# Altium schematic sheet Ctrl_Board.SchDoc
size 1016 x 673 mm
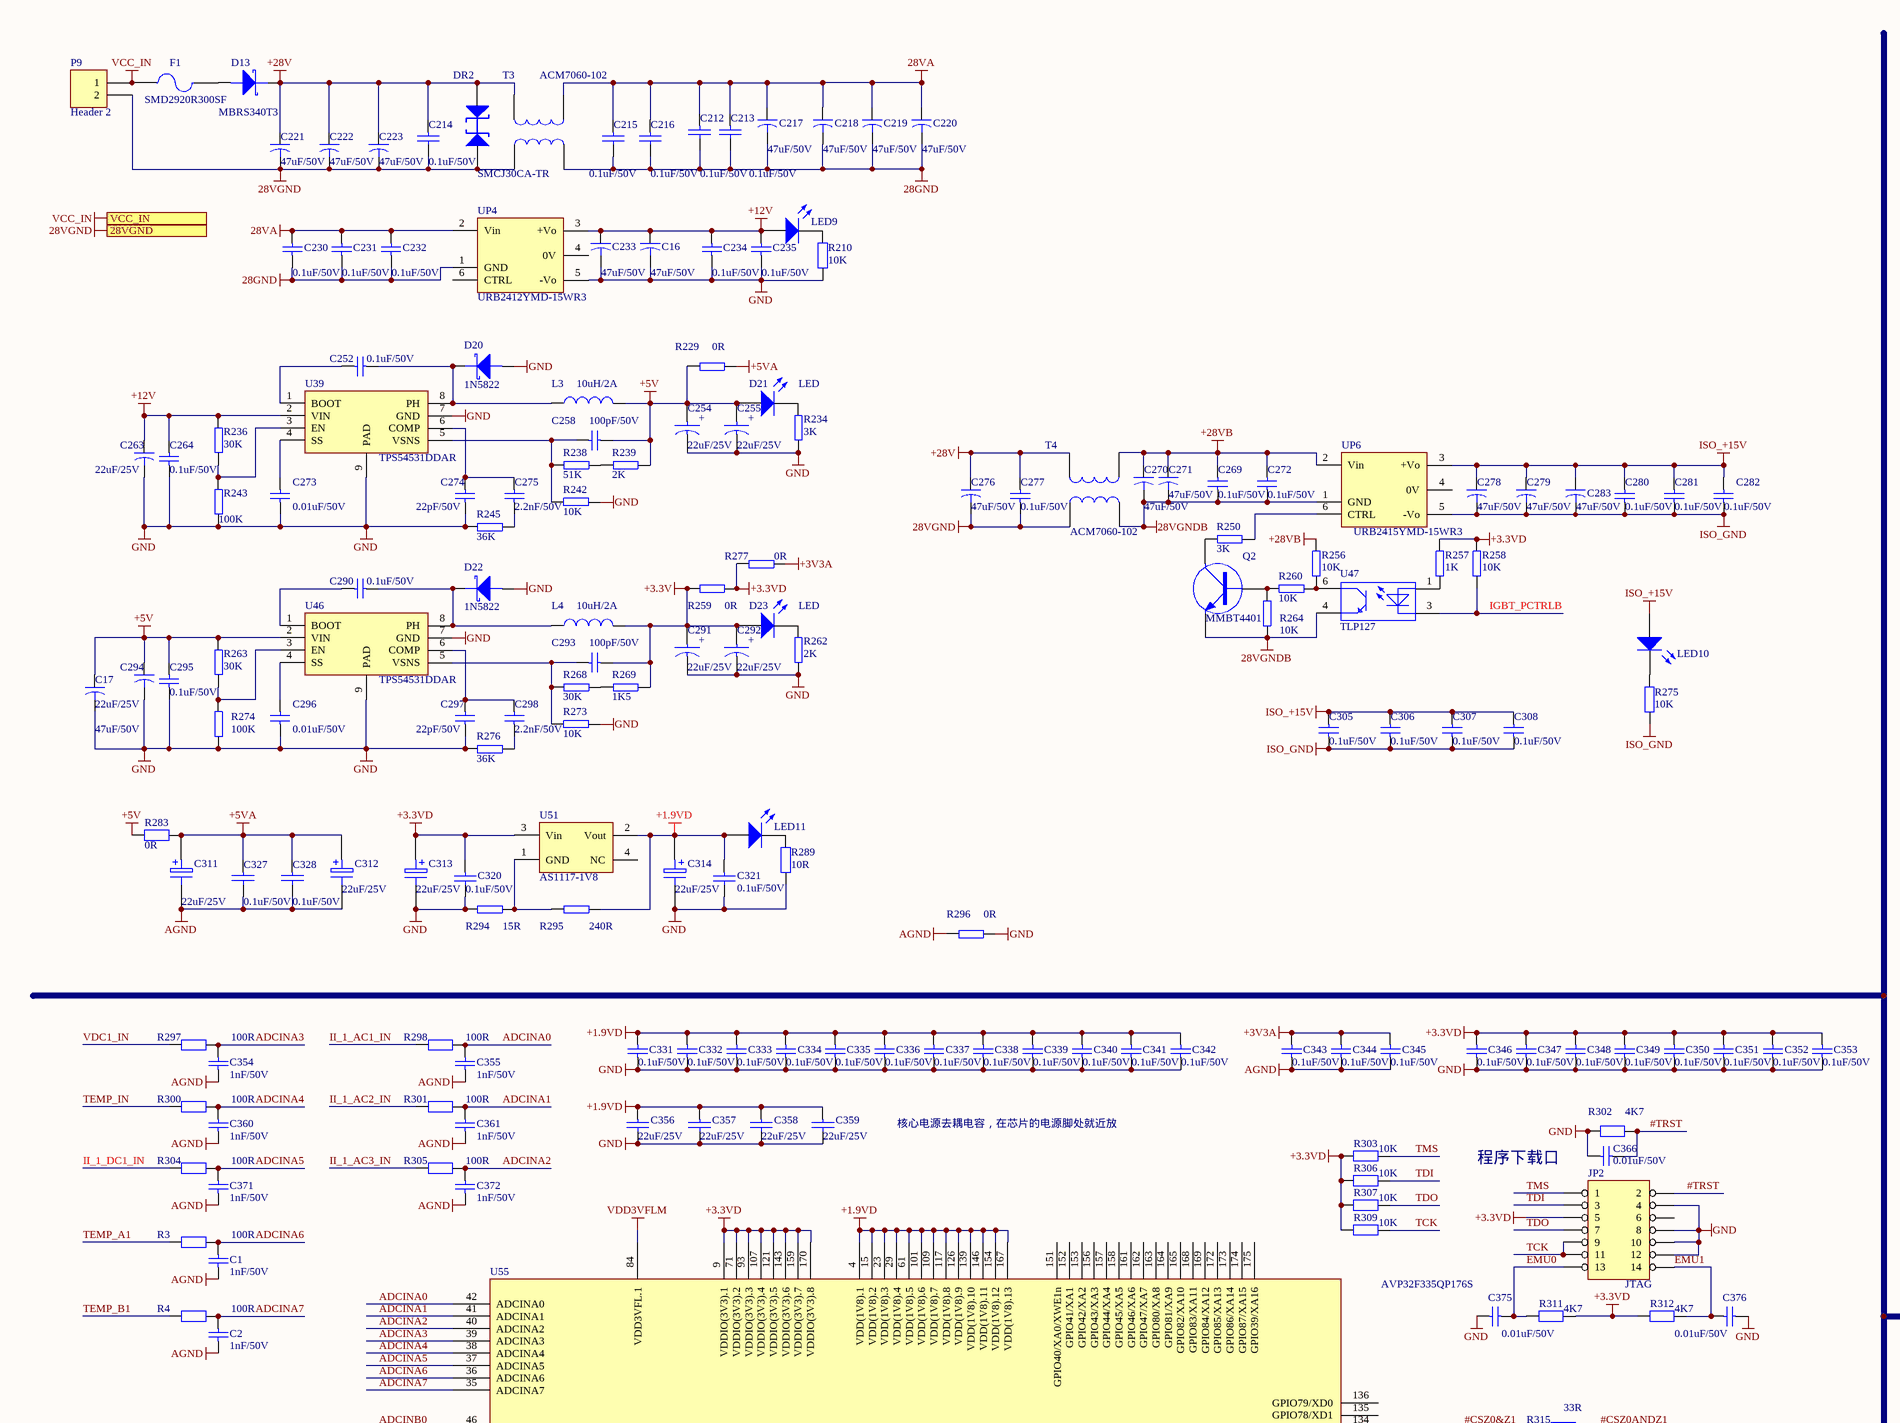
[diagram p0: Ctrl_Board.SchDoc, top left]
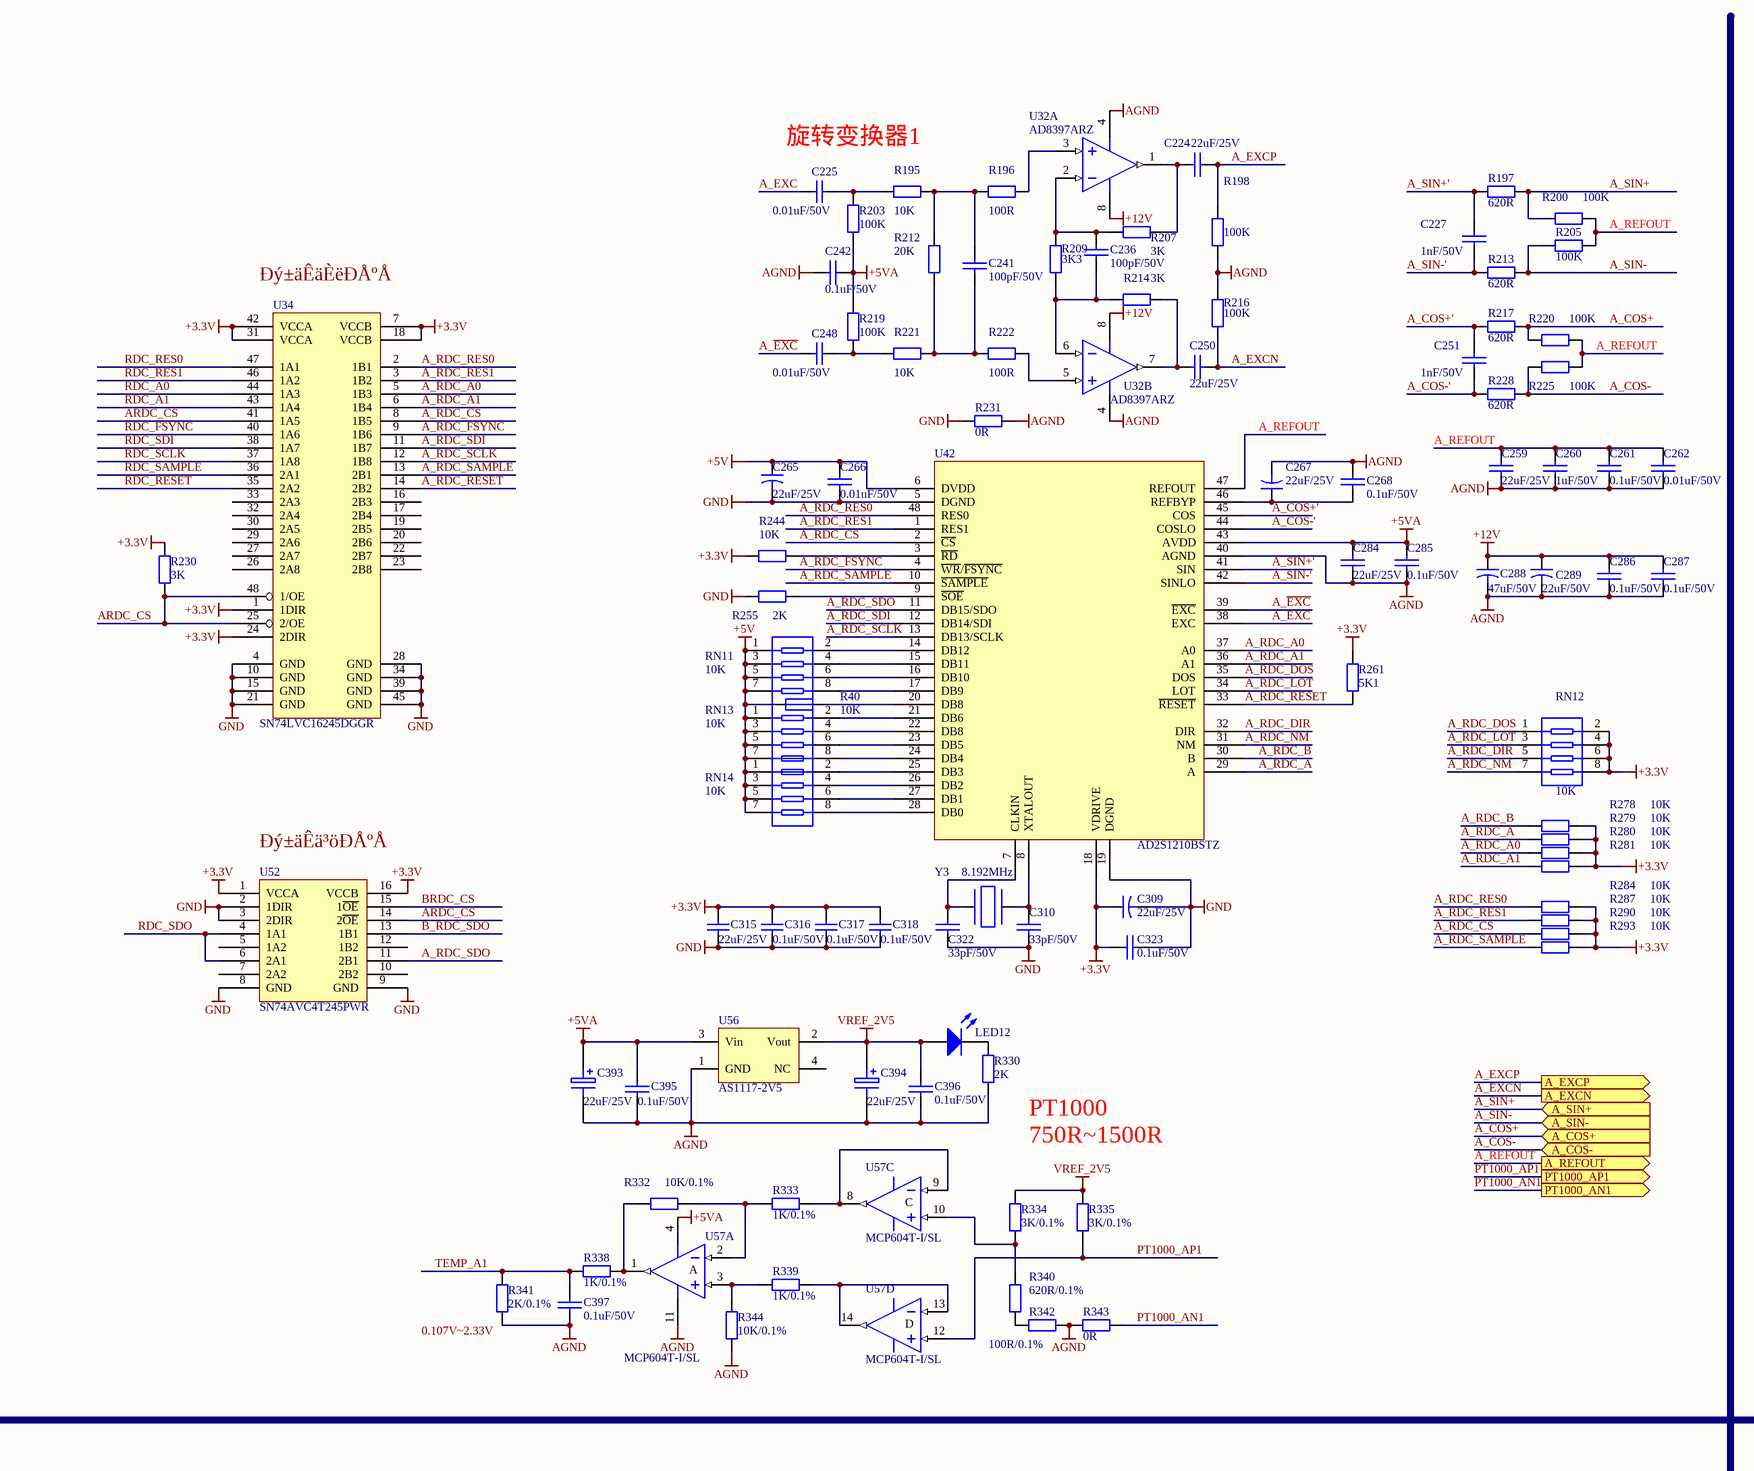
[diagram p1: Ctrl_Board.SchDoc, top middle]
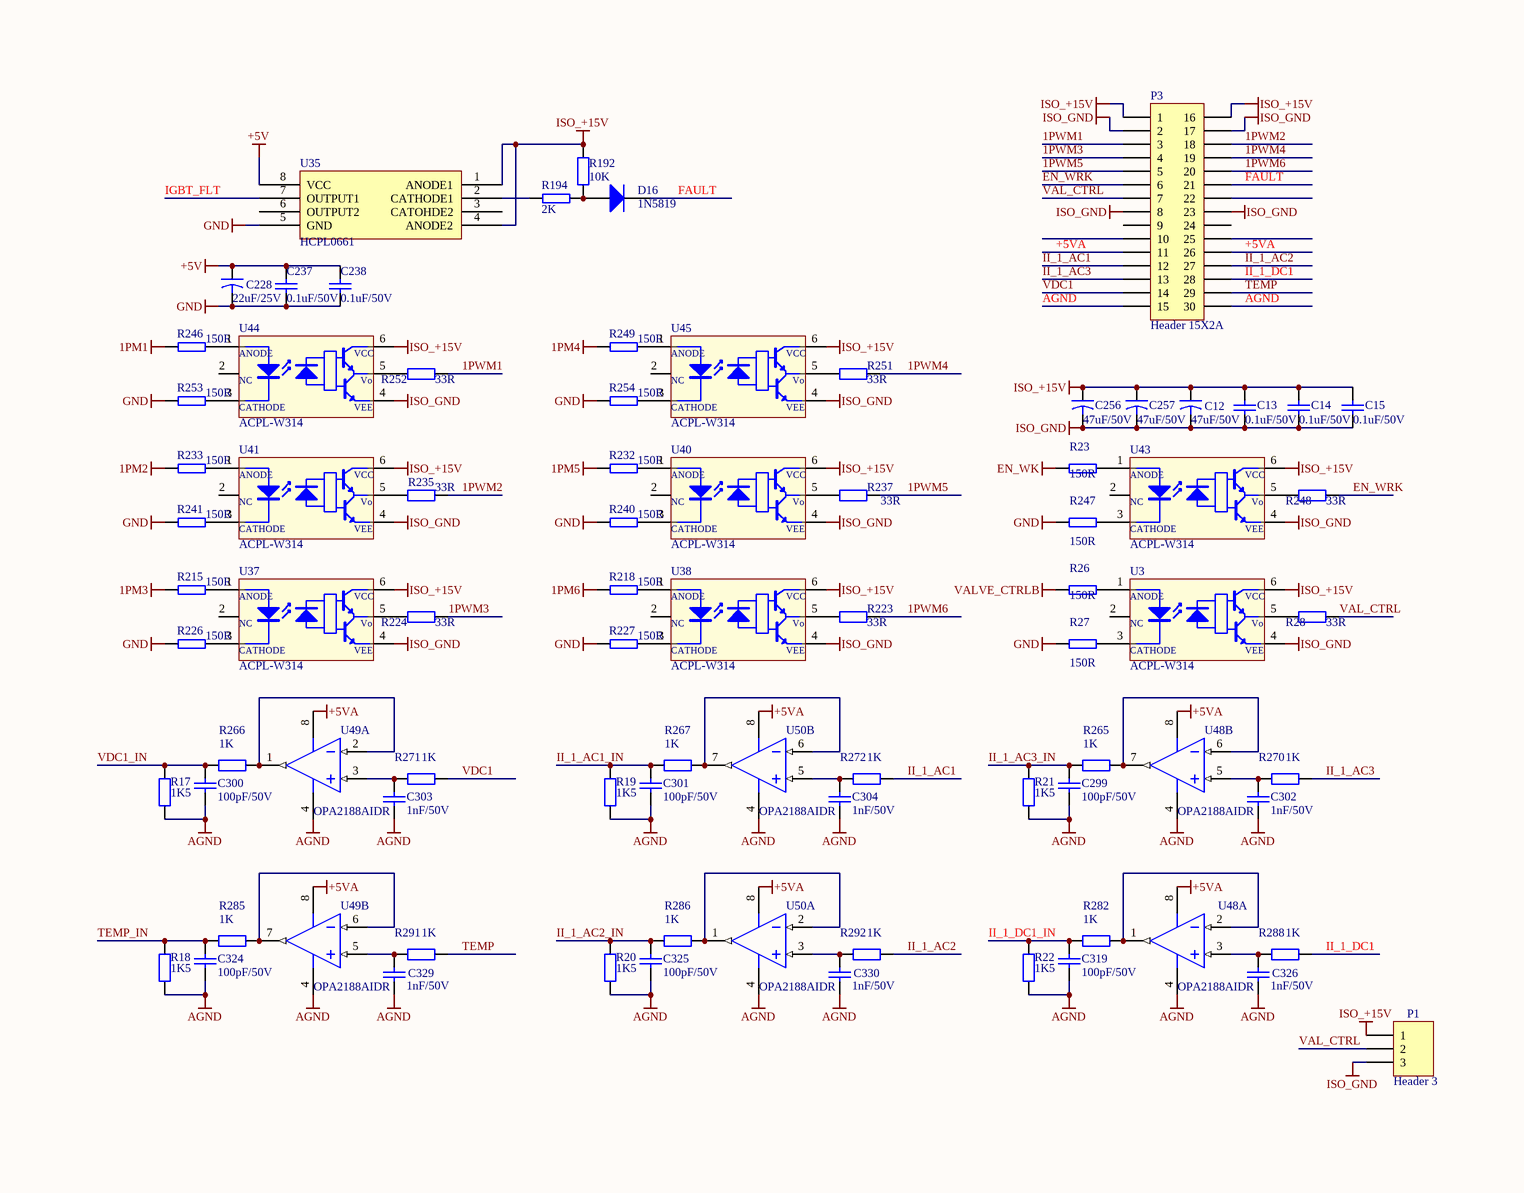
[diagram p2: Ctrl_Board.SchDoc, top right]
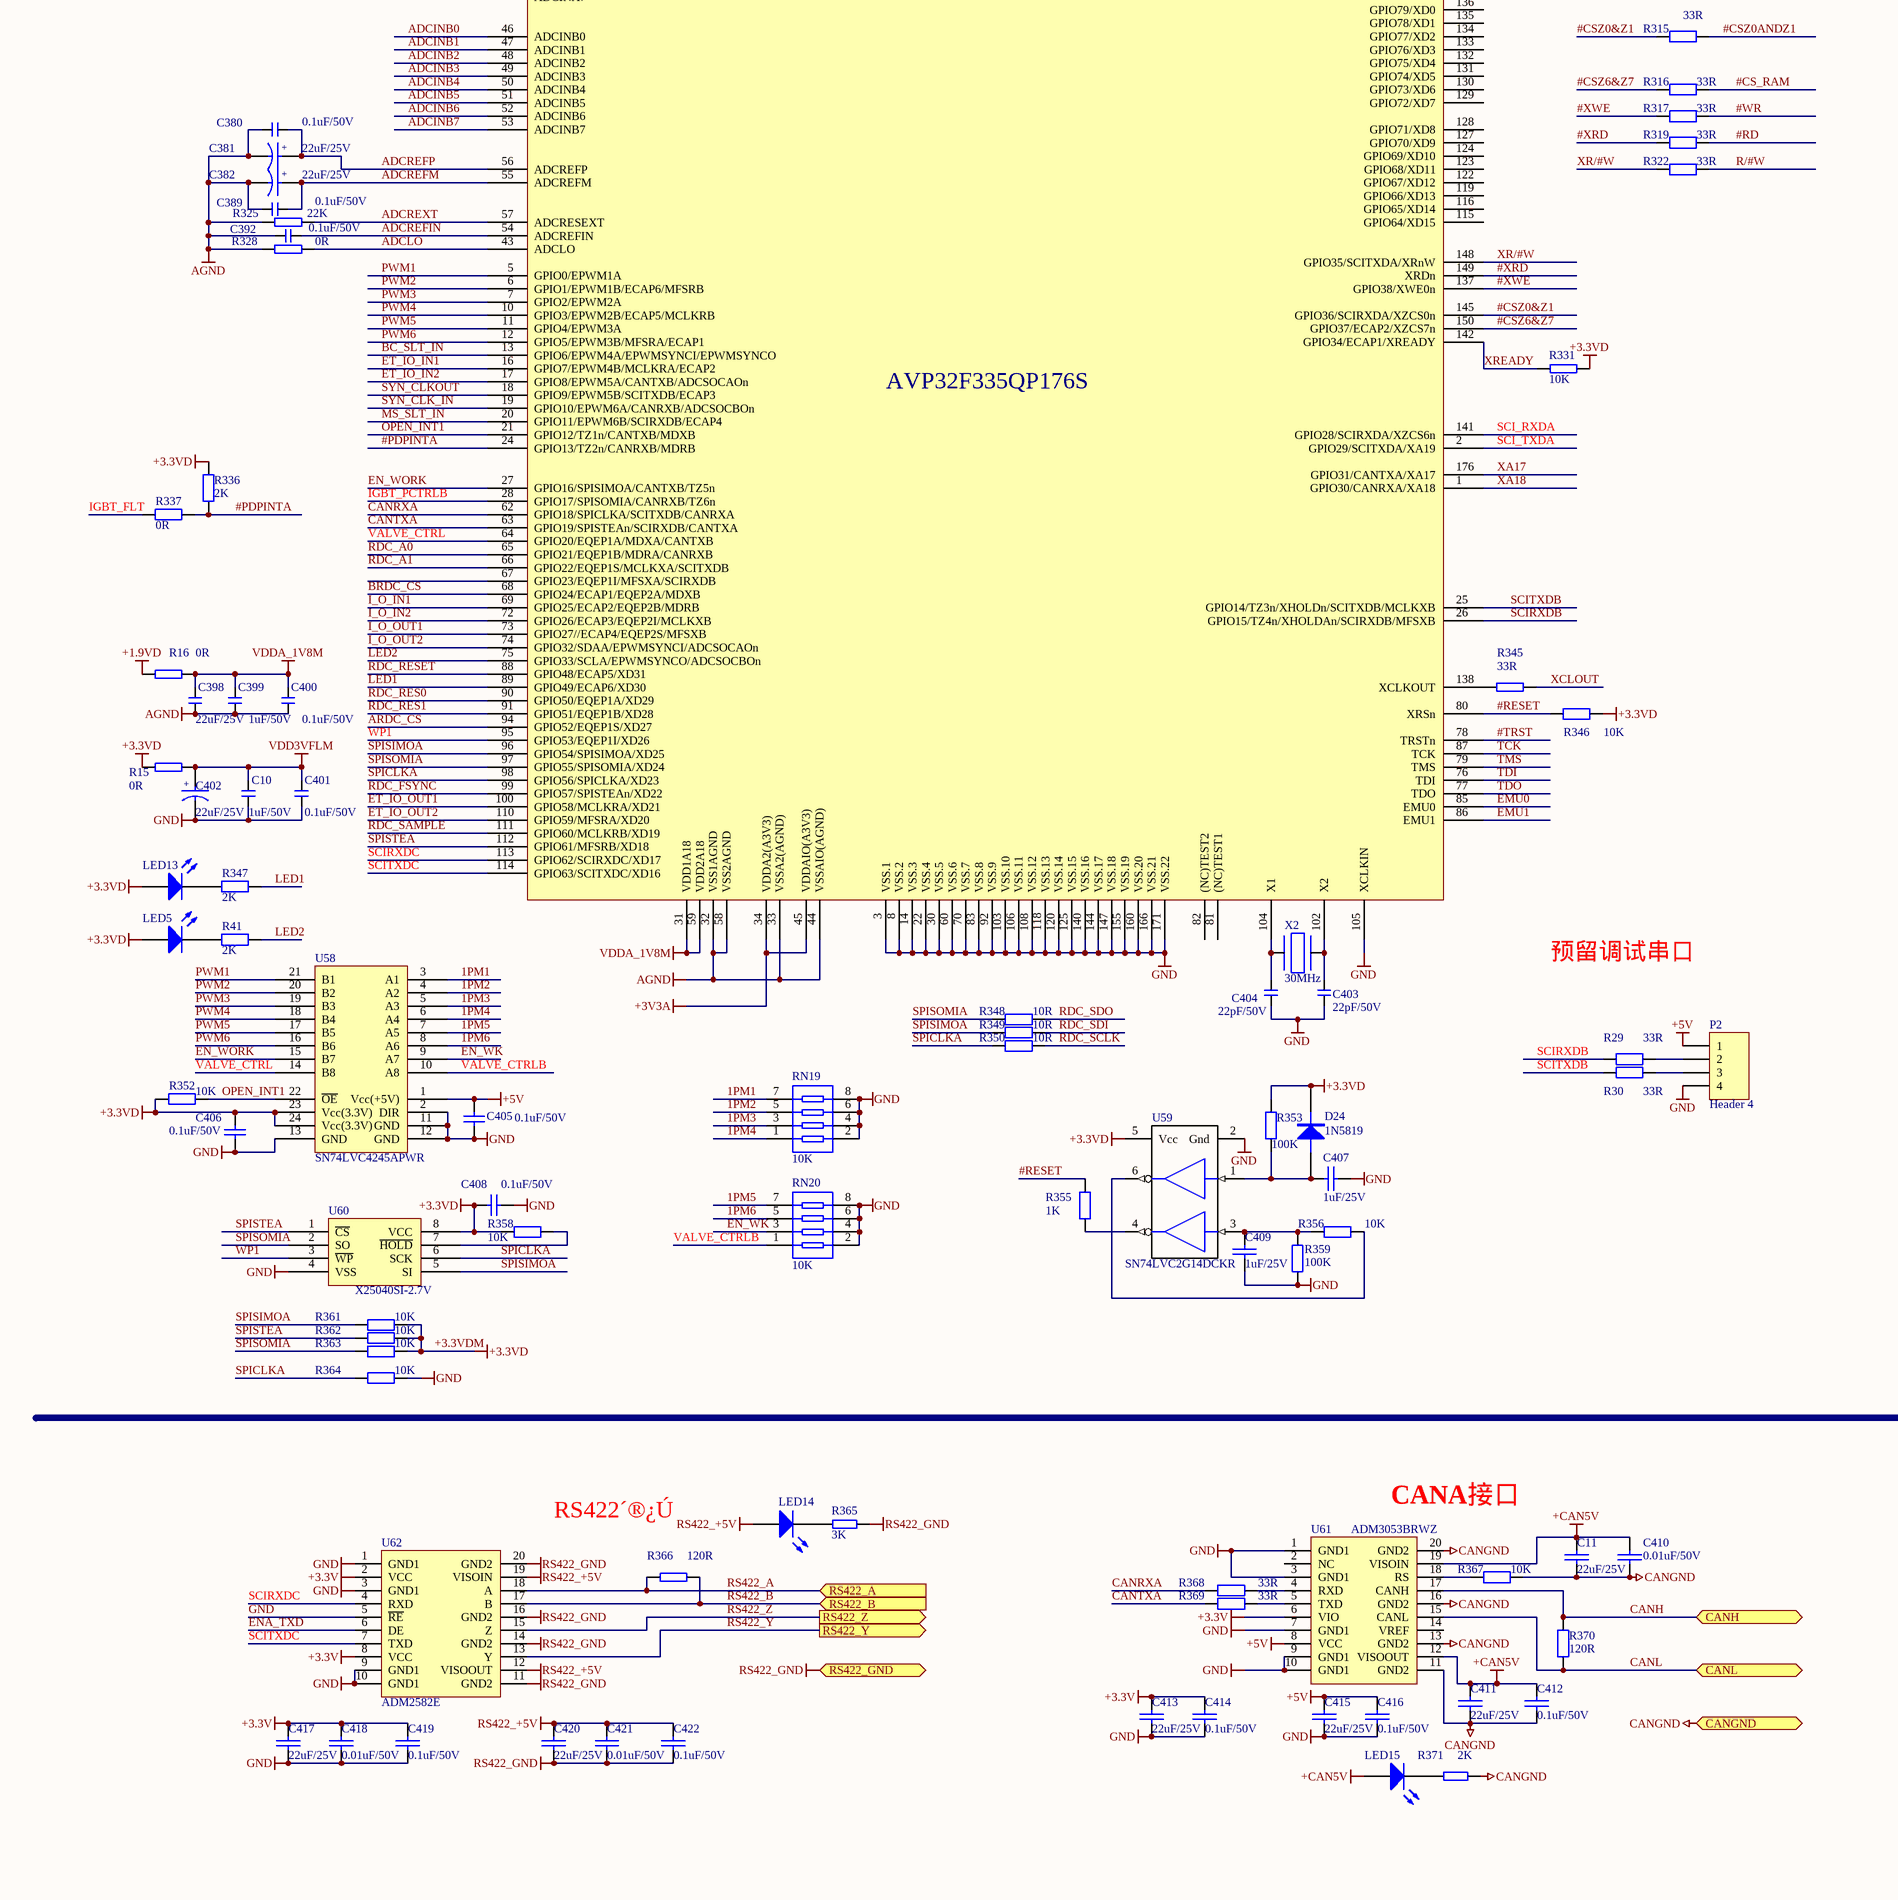
[diagram p3: Ctrl_Board.SchDoc, bottom left]
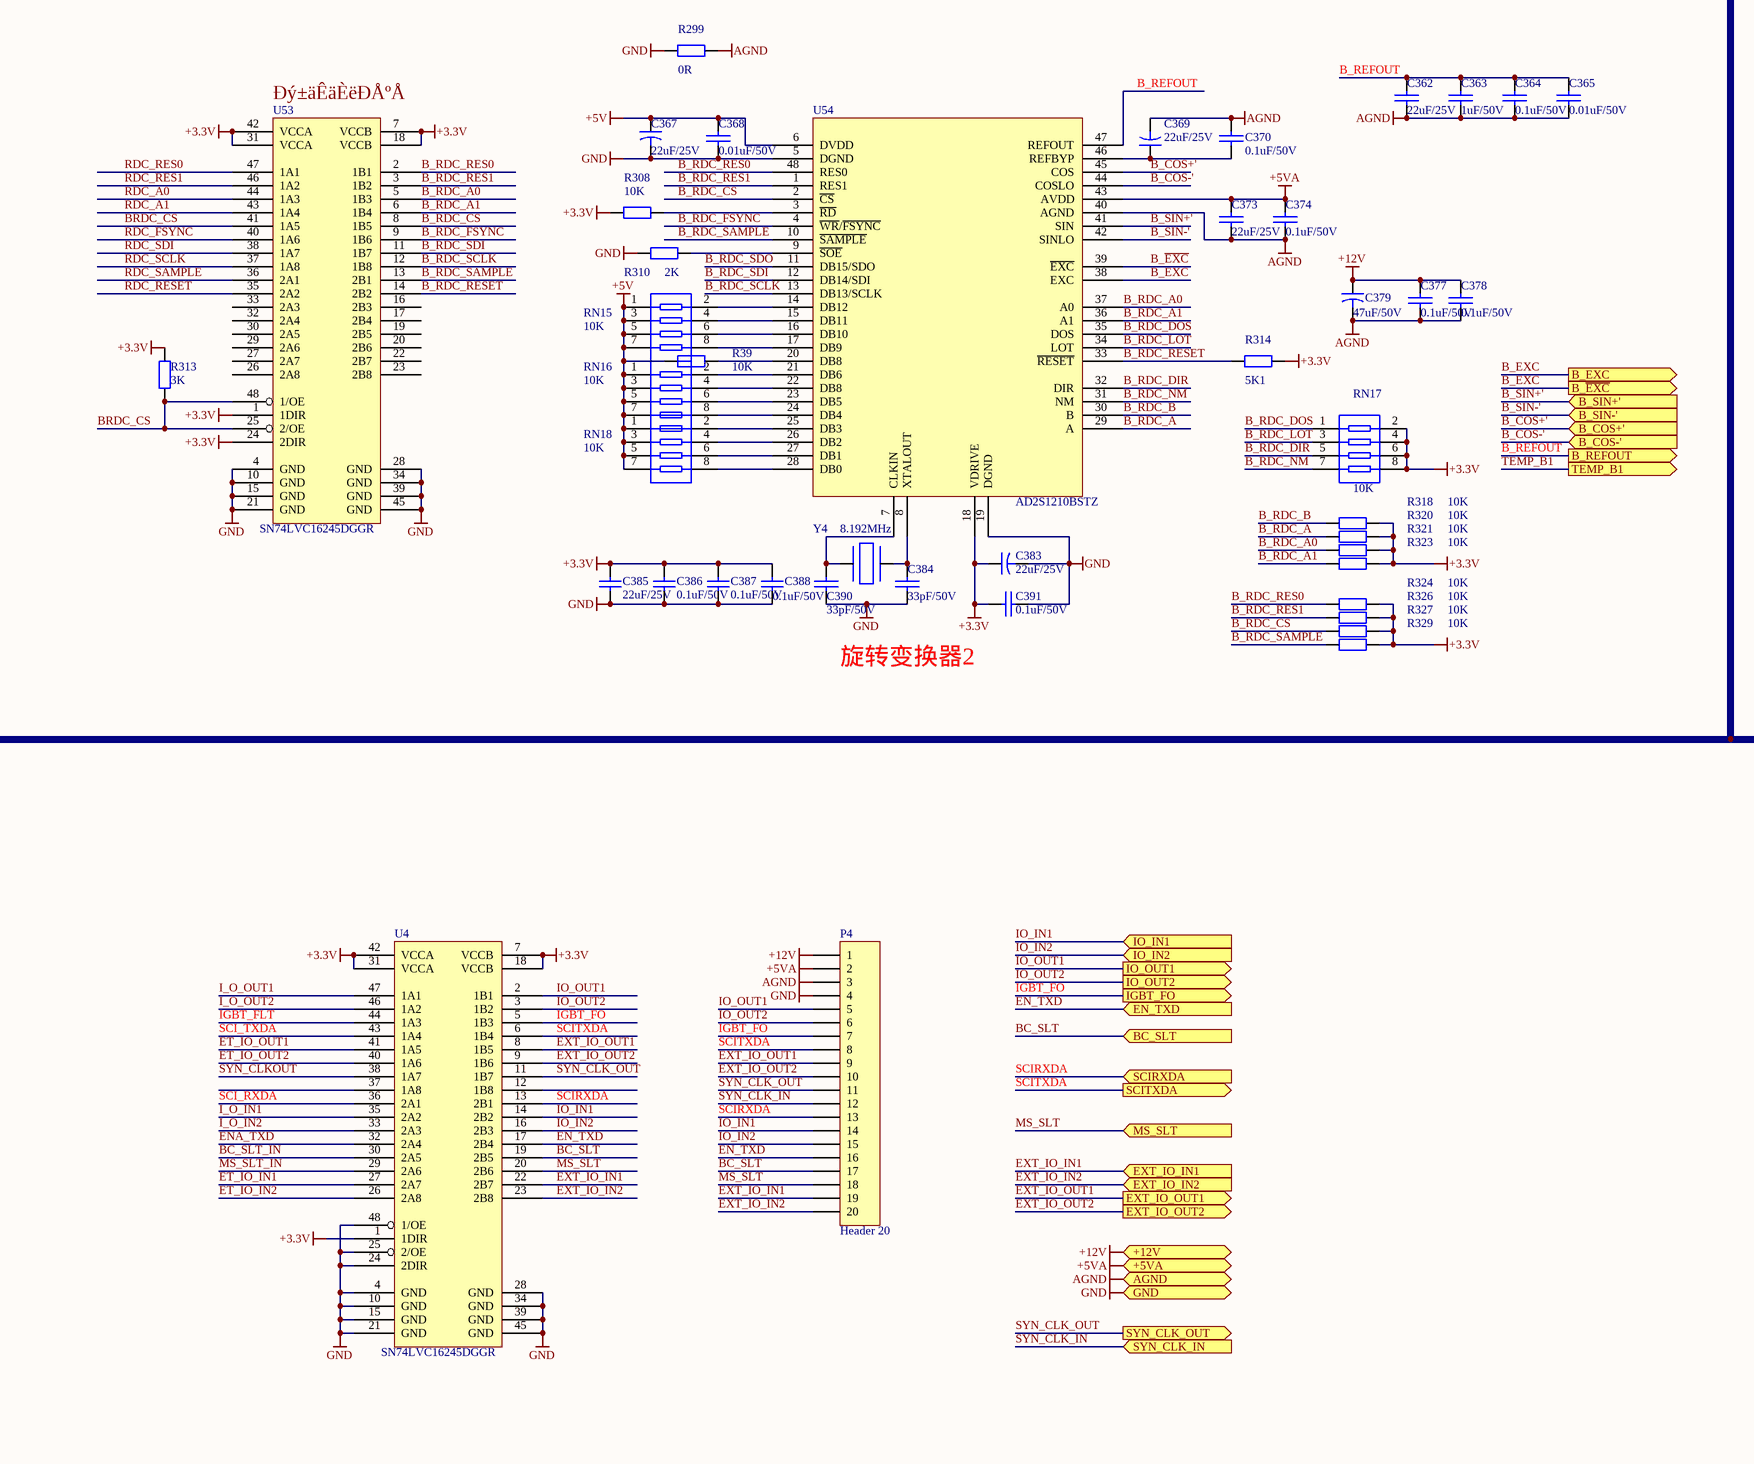
[diagram p4: Ctrl_Board.SchDoc, bottom middle]

## Parts
C1  1nF/50V  [WP_0603C]
C2  1nF/50V  [WP_0603C]
C10  1uF/50V  [WP_0603C]
C11  22uF/25V  [WP_1206CC]
C12  47uF/50V  [WP_1210CC]
C13  0.1uF/50V  [WP_0603C]
C14  0.1uF/50V  [WP_0603C]
C15  0.1uF/50V  [WP_0603C]
C16  47uF/50V  [WP_1210CC]
C17  47uF/50V  [WP_1210CC]
C212  0.1uF/50V  [WP_0603C]
C213  0.1uF/50V  [WP_0603C]
C214  0.1uF/50V  [WP_0603C]
C215  0.1uF/50V  [WP_0603C]
C216  0.1uF/50V  [WP_0603C]
C217  47uF/50V  [WP_1210CC]
C218  47uF/50V  [WP_1210CC]
C219  47uF/50V  [WP_1210CC]
C220  47uF/50V  [WP_1210CC]
C221  47uF/50V  [WP_1210CC]
C222  47uF/50V  [WP_1210CC]
C223  47uF/50V  [WP_1210CC]
C224  22uF/25V  [WP_1206CC]
C225  0.01uF/50V  [WP_0603C]
C227  1nF/50V  [WP_0603C]
C228  22uF/25V  [WP_1206CC]
C230  0.1uF/50V  [WP_0603C]
C231  0.1uF/50V  [WP_0603C]
C232  0.1uF/50V  [WP_0603C]
C233  47uF/50V  [WP_1210CC]
C234  0.1uF/50V  [WP_0603C]
C235  0.1uF/50V  [WP_0603C]
C236  100pF/50V  [WP_0603C]
C237  0.1uF/50V  [WP_0603C]
C238  0.1uF/50V  [WP_0603C]
C241  100pF/50V  [WP_0603C]
C242  0.1uF/50V  [WP_0603C]
C248  0.01uF/50V  [WP_0603C]
C250  22uF/25V  [WP_1206CC]
C251  1nF/50V  [WP_0603C]
C252  0.1uF/50V  [WP_0603C]
C254  22uF/25V  [WP_1206CC]
C255  22uF/25V  [WP_1206CC]
C256  47uF/50V  [WP_1210CC]
C257  47uF/50V  [WP_1210CC]
C258  100pF/50V  [WP_0603C]
C259  22uF/25V  [WP_1206CC]
C260  1uF/50V  [WP_0603C]
C261  0.1uF/50V  [WP_0603C]
C262  0.01uF/50V  [WP_0603C]
C263  22uF/25V  [WP_1206CC]
C264  0.1uF/50V  [WP_0603C]
C265  22uF/25V  [WP_1206CC]
C266  0.01uF/50V  [WP_0603C]
C267  22uF/25V  [WP_1206CC]
C268  0.1uF/50V  [WP_0603C]
C269  0.1uF/50V  [WP_0603C]
C270  47uF/50V  [WP_1210CC]
C271  47uF/50V  [WP_1210CC]
C272  0.1uF/50V  [WP_0603C]
C273  0.01uF/50V  [WP_0603C]
C274  22pF/50V  [WP_0603C]
C275  2.2nF/50V  [WP_0603C]
C276  47uF/50V  [WP_1210CC]
C277  0.1uF/50V  [WP_0603C]
C278  47uF/50V  [WP_1210CC]
C279  47uF/50V  [WP_1210CC]
C280  0.1uF/50V  [WP_0603C]
C281  0.1uF/50V  [WP_0603C]
C282  0.1uF/50V  [WP_0603C]
C283  47uF/50V  [WP_1210CC]
C284  22uF/25V  [WP_1206CC]
C285  0.1uF/50V  [WP_0603C]
C286  0.1uF/50V  [WP_0603C]
C287  0.1uF/50V  [WP_0603C]
C288  47uF/50V  [WP_1210CC]
C289  22uF/50V  [WP_1206CC]
C290  0.1uF/50V  [WP_0603C]
C291  22uF/25V  [WP_1206CC]
C292  22uF/25V  [WP_1206CC]
C293  100pF/50V  [WP_0603C]
C294  22uF/25V  [WP_1206CC]
C295  0.1uF/50V  [WP_0603C]
C296  0.01uF/50V  [WP_0603C]
C297  22pF/50V  [WP_0603C]
C298  2.2nF/50V  [WP_0603C]
C299  100pF/50V  [WP_0603C]
C300  100pF/50V  [WP_0603C]
C301  100pF/50V  [WP_0603C]
C302  1nF/50V  [WP_0603C]
C303  1nF/50V  [WP_0603C]
C304  1nF/50V  [WP_0603C]
C305  0.1uF/50V  [WP_0603C]
C306  0.1uF/50V  [WP_0603C]
C307  0.1uF/50V  [WP_0603C]
C308  0.1uF/50V  [WP_0603C]
C309  22uF/25V  [WP_1206CC]
C310  33pF/50V  [WP_0603C]
C311  22uF/25V  [WP_1206CC]
C312  22uF/25V  [WP_1206CC]
C313  22uF/25V  [WP_1206CC]
C314  22uF/25V  [WP_1206CC]
C315  22uF/25V  [WP_1206CC]
C316  0.1uF/50V  [WP_0603C]
C317  0.1uF/50V  [WP_0603C]
C318  0.1uF/50V  [WP_0603C]
C319  100pF/50V  [WP_0603C]
C320  0.1uF/50V  [WP_0603C]
C321  0.1uF/50V  [WP_0603C]
C322  33pF/50V  [WP_0603C]
C323  0.1uF/50V  [WP_0603C]
C324  100pF/50V  [WP_0603C]
C325  100pF/50V  [WP_0603C]
C326  1nF/50V  [WP_0603C]
C327  0.1uF/50V  [WP_0603C]
C328  0.1uF/50V  [WP_0603C]
C329  1nF/50V  [WP_0603C]
C330  1nF/50V  [WP_0603C]
C331  0.1uF/50V  [WP_0603C]
C332  0.1uF/50V  [WP_0603C]
C333  0.1uF/50V  [WP_0603C]
C334  0.1uF/50V  [WP_0603C]
C335  0.1uF/50V  [WP_0603C]
C336  0.1uF/50V  [WP_0603C]
C337  0.1uF/50V  [WP_0603C]
C338  0.1uF/50V  [WP_0603C]
C339  0.1uF/50V  [WP_0603C]
C340  0.1uF/50V  [WP_0603C]
C341  0.1uF/50V  [WP_0603C]
C342  0.1uF/50V  [WP_0603C]
C343  0.1uF/50V  [WP_0603C]
C344  0.1uF/50V  [WP_0603C]
C345  0.1uF/50V  [WP_0603C]
C346  0.1uF/50V  [WP_0603C]
C347  0.1uF/50V  [WP_0603C]
C348  0.1uF/50V  [WP_0603C]
C349  0.1uF/50V  [WP_0603C]
C350  0.1uF/50V  [WP_0603C]
C351  0.1uF/50V  [WP_0603C]
C352  0.1uF/50V  [WP_0603C]
C353  0.1uF/50V  [WP_0603C]
C354  1nF/50V  [WP_0603C]
C355  1nF/50V  [WP_0603C]
C356  22uF/25V  [WP_1206CC]
C357  22uF/25V  [WP_1206CC]
C358  22uF/25V  [WP_1206CC]
C359  22uF/25V  [WP_1206CC]
C360  1nF/50V  [WP_0603C]
C361  1nF/50V  [WP_0603C]
C362  22uF/25V  [WP_1206CC]
C363  1uF/50V  [WP_0603C]
C364  0.1uF/50V  [WP_0603C]
C365  0.01uF/50V  [WP_0603C]
C366  0.01uF/50V  [WP_0603C]
C367  22uF/25V  [WP_1206CC]
C368  0.01uF/50V  [WP_0603C]
C369  22uF/25V  [WP_1206CC]
C370  0.1uF/50V  [WP_0603C]
C371  1nF/50V  [WP_0603C]
C372  1nF/50V  [WP_0603C]
C373  22uF/25V  [WP_1206CC]
C374  0.1uF/50V  [WP_0603C]
C375  0.01uF/50V  [WP_0603C]
C376  0.01uF/50V  [WP_0603C]
C377  0.1uF/50V  [WP_0603C]
C378  0.1uF/50V  [WP_0603C]
C379  47uF/50V  [WP_1210CC]
C380  0.1uF/50V  [WP_0603C]
C381  22uF/25V  [WP_1206CC]
C382  22uF/25V  [WP_1206CC]
C383  22uF/25V  [WP_1206CC]
C384  33pF/50V  [WP_0603C]
C385  22uF/25V  [WP_1206CC]
C386  0.1uF/50V  [WP_0603C]
C387  0.1uF/50V  [WP_0603C]
C388  0.1uF/50V  [WP_0603C]
C389  0.1uF/50V  [WP_0603C]
C390  33pF/50V  [WP_0603C]
C391  0.1uF/50V  [WP_0603C]
C392  0.1uF/50V  [WP_0603C]
C393  22uF/25V  [WP_1206CC]
C394  22uF/25V  [WP_1206CC]
C395  0.1uF/50V  [WP_0603C]
C396  0.1uF/50V  [WP_0603C]
C397  0.1uF/50V  [WP_0603C]
C398  22uF/25V  [WP_1206CC]
C399  1uF/50V  [WP_0603C]
C400  0.1uF/50V  [WP_0603C]
C401  0.1uF/50V  [WP_0603C]
C402  22uF/25V  [WP_1206CC]
C403  22pF/50V  [WP_0603C]
C404  22pF/50V  [WP_0603C]
C405  0.1uF/50V  [WP_0603C]
C406  0.1uF/50V  [WP_0603C]
C407  1uF/25V  [WP_0603C]
C408  0.1uF/50V  [WP_0603C]
C409  1uF/25V  [WP_0603C]
C410  0.01uF/50V  [WP_0603C]
C411  22uF/25V  [WP_1206CC]
C412  0.1uF/50V  [WP_0603C]
C413  22uF/25V  [WP_1206CC]
C414  0.1uF/50V  [WP_0603C]
C415  22uF/25V  [WP_1206CC]
C416  0.1uF/50V  [WP_0603C]
C417  22uF/25V  [WP_1206CC]
C418  0.01uF/50V  [WP_0603C]
C419  0.1uF/50V  [WP_0603C]
C420  22uF/25V  [WP_1206CC]
C421  0.01uF/50V  [WP_0603C]
C422  0.1uF/50V  [WP_0603C]
D13  MBRS340T3  [WP_SMC_DO214AB]
D16  1N5819  [WP_SOD-323]
D20  1N5822  [WP_SMA_DO214AC]
D21  LED  [WP_0603_LED]
D22  1N5822  [WP_SMA_DO214AC]
D23  LED  [WP_0603_LED]
D24  1N5819  [WP_SOD-323]
DR2  SMCJ30CA-TR  [WP_SMC_DO214AB]
F1  SMD2920R300SF  [WP_2420]
JP2  JTAG  [WP_IDC14]
L3  10uH/2A  [WP_LBS6*6]
L4  10uH/2A  [WP_LBS6*6]
LED5  LED  [WP_0603_LED]  (value not drawn)
LED9  LED  [WP_0603_LED]  (value not drawn)
LED10  LED  [WP_0603_LED]  (value not drawn)
LED11  LED  [WP_0603_LED]  (value not drawn)
LED12  LED  [WP_0603_LED]  (value not drawn)
LED13  LED  [WP_0603_LED]  (value not drawn)
LED14  LED  [WP_0603_LED]  (value not drawn)
LED15  LED  [WP_0603_LED]  (value not drawn)
P1  Header 3  [WP_SIP3]
P2  Header 4  [WP_SIP4]
P3  Header 15X2A  [WP_CRM222-030]
P4  Header 20  [WP_HEADER20S]
P9  Header 2  [WP_LSIP2]
Q2  MMBT4401  [WP_SOT23B]
R3  100R  [WP_0603R]
R4  100R  [WP_0603R]
R15  0R  [WP_0603R]
R16  0R  [WP_0603R]
R17  1K5  [WP_0603R]
R18  1K5  [WP_0603R]
R19  1K5  [WP_0603R]
R20  1K5  [WP_0603R]
R21  1K5  [WP_0603R]
R22  1K5  [WP_0603R]
R23  150R  [WP_0603R]
R26  150R  [WP_0603R]
R27  150R  [WP_0603R]
R28  33R  [WP_0603R]
R29  33R  [WP_0603R]
R30  33R  [WP_0603R]
R39  10K  [WP_0603R]
R40  10K  [WP_0603R]
R41  2K  [WP_0603R]
R192  10K  [WP_0603R]
R194  2K  [WP_0603R]
R195  10K  [WP_0603R]
R196  100R  [WP_0603R]
R197  620R  [WP_0603R]
R198  100K  [WP_0603R]
R200  100K  [WP_0603R]
R203  100K  [WP_0603R]
R205  100K  [WP_0603R]
R207  3K  [WP_0603R]
R209  3K3  [WP_0603R]
R210  10K  [WP_0603R]
R212  20K  [WP_0603R]
R213  620R  [WP_0603R]
R214  3K  [WP_0603R]
R215  150R  [WP_0603R]
R216  100K  [WP_0603R]
R217  620R  [WP_0603R]
R218  150R  [WP_0603R]
R219  100K  [WP_0603R]
R220  100K  [WP_0603R]
R221  10K  [WP_0603R]
R222  100R  [WP_0603R]
R223  33R  [WP_0603R]
R224  33R  [WP_0603R]
R225  100K  [WP_0603R]
R226  150R  [WP_0603R]
R227  150R  [WP_0603R]
R228  620R  [WP_0603R]
R229  0R  [WP_JS2]
R230  3K  [WP_0603R]
R231  0R  [WP_JS2]
R232  150R  [WP_0603R]
R233  150R  [WP_0603R]
R234  3K  [WP_0603R]
R235  33R  [WP_0603R]
R236  30K  [WP_0603R]
R237  33R  [WP_0603R]
R238  51K  [WP_0603R]
R239  2K  [WP_0603R]
R240  150R  [WP_0603R]
R241  150R  [WP_0603R]
R242  10K  [WP_0603R]
R243  100K  [WP_0603R]
R244  10K  [WP_0603R]
R245  36K  [WP_0603R]
R246  150R  [WP_0603R]
R247  150R  [WP_0603R]
R248  33R  [WP_0603R]
R249  150R  [WP_0603R]
R250  3K  [WP_0603R]
R251  33R  [WP_0603R]
R252  33R  [WP_0603R]
R253  150R  [WP_0603R]
R254  150R  [WP_0603R]
R255  2K  [WP_0603R]
R256  10K  [WP_0603R]
R257  1K  [WP_0603R]
R258  10K  [WP_0603R]
R259  0R  [WP_JS2]
R260  10K  [WP_0603R]
R261  5K1  [WP_0603R]
R262  2K  [WP_0603R]
R263  30K  [WP_0603R]
R264  10K  [WP_0603R]
R265  1K  [WP_0603R]
R266  1K  [WP_0603R]
R267  1K  [WP_0603R]
R268  30K  [WP_0603R]
R269  1K5  [WP_0603R]
R270  1K  [WP_0603R]
R271  1K  [WP_0603R]
R272  1K  [WP_0603R]
R273  10K  [WP_0603R]
R274  100K  [WP_0603R]
R275  10K  [WP_0603R]
R276  36K  [WP_0603R]
R277  0R  [WP_0603R]
R278  10K  [WP_0603R]
R279  10K  [WP_0603R]
R280  10K  [WP_0603R]
R281  10K  [WP_0603R]
R282  1K  [WP_0603R]
R283  0R  [WP_JS2]
R284  10K  [WP_0603R]
R285  1K  [WP_0603R]
R286  1K  [WP_0603R]
R287  10K  [WP_0603R]
R288  1K  [WP_0603R]
R289  10R  [WP_0603R]
R290  10K  [WP_0603R]
R291  1K  [WP_0603R]
R292  1K  [WP_0603R]
R293  10K  [WP_0603R]
R294  15R  [WP_0603R]
R295  240R  [WP_0603R]
R296  0R  [WP_JS2]
R297  100R  [WP_0603R]
R298  100R  [WP_0603R]
R299  0R  [WP_0603R]
R300  100R  [WP_0603R]
R301  100R  [WP_0603R]
R302  4K7  [WP_0603R]
R303  10K  [WP_0603R]
R304  100R  [WP_0603R]
R305  100R  [WP_0603R]
R306  10K  [WP_0603R]
R307  10K  [WP_0603R]
R308  10K  [WP_0603R]
R309  10K  [WP_0603R]
R310  2K  [WP_0603R]
R311  4K7  [WP_0603R]
R312  4K7  [WP_0603R]
R313  3K  [WP_0603R]
R314  5K1  [WP_0603R]
R315  33R  [WP_0603R]
R316  33R  [WP_0603R]
R317  33R  [WP_0603R]
R318  10K  [WP_0603R]
R319  33R  [WP_0603R]
R320  10K  [WP_0603R]
R321  10K  [WP_0603R]
R322  33R  [WP_0603R]
R323  10K  [WP_0603R]
R324  10K  [WP_0603R]
R325  22K  [WP_0603R]
R326  10K  [WP_0603R]
R327  10K  [WP_0603R]
R328  0R  [WP_0603R]
R329  10K  [WP_0603R]
R330  2K  [WP_0603R]
R331  10K  [WP_0603R]
R332  10K/0.1%  [WP_0603R]
R333  1K/0.1%  [WP_0603R]
R334  3K/0.1%  [WP_0603R]
R335  3K/0.1%  [WP_0603R]
R336  2K  [WP_0603R]
R337  0R  [WP_0603R]
R338  1K/0.1%  [WP_0603R]
R339  1K/0.1%  [WP_0603R]
R340  620R/0.1%  [WP_0603R]
R341  2K/0.1%  [WP_0603R]
R342  100R/0.1%  [WP_0603R]
R343  0R  [WP_0603R]
R344  10K/0.1%  [WP_0603R]
R345  33R  [WP_0603R]
R346  10K  [WP_0603R]
R347  2K  [WP_0603R]
R348  10R  [WP_0603R]
R349  10R  [WP_0603R]
R350  10R  [WP_0603R]
R352  10K  [WP_0603R]
R353  100K  [WP_0603R]
R355  1K  [WP_0603R]
R356  10K  [WP_0603R]
R358  10K  [WP_0603R]
R359  100K  [WP_0603R]
R361  10K  [WP_0603R]
R362  10K  [WP_0603R]
R363  10K  [WP_0603R]
R364  10K  [WP_0603R]
R365  3K  [WP_0603R]
R366  120R  [WP_0603R]
R367  10K  [WP_0603R]
R368  33R  [WP_0603R]
R369  33R  [WP_0603R]
R370  120R  [WP_0603R]
R371  2K  [WP_0603R]
RN11  10K  [WP_RP4]
RN12  10K  [WP_RP4]
RN13  10K  [WP_RP4]
RN14  10K  [WP_RP4]
RN15  10K  [WP_RP4]
RN16  10K  [WP_RP4]
RN17  10K  [WP_RP4]
RN18  10K  [WP_RP4]
RN19  10K  [WP_RP4]
RN20  10K  [WP_RP4]
T3  ACM7060-102  [WP_ACM7060]
T4  ACM7060-102  [WP_ACM7060]
U3  ACPL-W314  [WP_SOIC6L]
U4  SN74LVC16245DGGR  [WP_TSSOP48]
U32  AD8397ARZ  [WP_SOIC8]  (parts A,B of 2)
U34  SN74LVC16245DGGR  [WP_TSSOP48]
U35  HCPL0661  [WP_SOIC8]
U37  ACPL-W314  [WP_SOIC6L]
U38  ACPL-W314  [WP_SOIC6L]
U39  TPS54531DDAR  [WP_SOIC8P]
U40  ACPL-W314  [WP_SOIC6L]
U41  ACPL-W314  [WP_SOIC6L]
U42  AD2S1210BSTZ  [WP_TQ48]
U43  ACPL-W314  [WP_SOIC6L]
U44  ACPL-W314  [WP_SOIC6L]
U45  ACPL-W314  [WP_SOIC6L]
U46  TPS54531DDAR  [WP_SOIC8P]
U47  TLP127  [WP_SOP4]
U48  OPA2188AIDR  [WP_SOIC8]  (parts A,B of 2)
U49  OPA2188AIDR  [WP_SOIC8]  (parts A,B of 2)
U50  OPA2188AIDR  [WP_SOIC8]  (parts A,B of 2)
U51  AS1117-1V8  [WP_SOT223]
U52  SN74AVC4T245PWR  [WP_TSSOP16]
U53  SN74LVC16245DGGR  [WP_TSSOP48]
U54  AD2S1210BSTZ  [WP_TQ48]
U55  AVP32F335QP176S  [WP_PQFP176]
U56  AS1117-2V5  [WP_SOT223]
U57  MCP604T-I/SL  [WP_SOIC14]  (parts A,C,D of 4)
U58  SN74LVC4245APWR  [WP_TSSOP24]
U59  SN74LVC2G14DCKR  [WP_SOT363]
U60  X25040SI-2.7V  [WP_SOIC8]
U61  ADM3053BRWZ  [WP_SOIC20L]
U62  ADM2582E  [WP_SOIC20L]
UP4  URB2412YMD-15WR3  [WP_YMD]
UP6  URB2415YMD-15WR3  [WP_YMD]
X2  30MHz  [WP_XTAL]
Y3  8.192MHz  [WP_5032]
Y4  8.192MHz  [WP_5032]

## Ports
28VGND (in), +5VA (bidir), +12V (bidir), A_COS+ (in), A_COS- (in), A_EXCN (out), A_EXCP (out), A_REFOUT (out), A_SIN+ (in), A_SIN- (in), AGND (bidir), B_COS+' (in), B_COS-' (in), B_EXC (out), B_REFOUT (out), B_SIN+' (in), B_SIN-' (in), B_~{EXC} (out), BC_SLT (in), CANGND (bidir), CANH (bidir), CANL (bidir), EN_TXD (in), EXT_IO_IN1 (in), EXT_IO_IN2 (in), EXT_IO_OUT1 (out), EXT_IO_OUT2 (out), GND (bidir), IGBT_FO (out), IO_IN1 (in), IO_IN2 (in), IO_OUT1 (out), IO_OUT2 (out), MS_SLT (in), PT1000_AN1 (out), PT1000_AP1 (out), RS422_A (in), RS422_B (in), RS422_GND (bidir), RS422_Y (out), RS422_Z (out), SCIRXDA (in), SCITXDA (out), SYN_CLK_IN (in), SYN_CLK_OUT (out), TEMP_B1 (out), VCC_IN (in)

## Nets
1PM1: R246.1 RN19.7 U58.3(A1)
1PM2: R233.1 RN19.5 U58.4(A2)
1PM3: R215.1 RN19.3 U58.5(A3)
1PM4: R249.1 RN19.1 U58.6(A4)
1PM5: R232.1 RN20.7 U58.7(A5)
1PM6: R218.1 RN20.5 U58.8(A6)
28GND: C212.2 C213.2 C215.2 C216.2 C217.2 C218.2 C219.2 C220.2 C230.1 C231.1 C232.1 T3.1 UP4.1(GND)
28VA: C212.1 C213.1 C215.1 C216.1 C217.1 C218.1 C219.1 C220.1 C230.2 C231.2 C232.2 T3.3 UP4.2(Vin)
28VGND: C214.2 C221.2 C222.2 C223.2 C276.2 C277.1 DR2.2(K) P9.2 T3.2 T4.4 ; port 28VGND
28VGNDB: C269.1 C270.2 C271.2 C272.1 Q2.2(E) R264.2 T4.3 U47.4 UP6.1(GND)
+1.9VD: C314.1 C321.1 C331.2 C332.2 C333.2 C334.2 C335.2 C336.2 C337.2 C338.2 C339.2 C340.2 C341.2 C342.2 C356.1 C357.1 C358.1 C359.1 LED11.1(A) R16.1 R295.2 U51.2(Vout) U55.4(VDD(1V8).1) U55.15(VDD(1V8).2) U55.23(VDD(1V8).3) U55.29(VDD(1V8).4) U55.61(VDD(1V8).5) U55.101(VDD(1V8).6) U55.109(VDD(1V8).7) U55.117(VDD(1V8).8) U55.126(VDD(1V8).9) U55.139(VDD(1V8).10) U55.146(VDD(1V8).11) U55.154(VDD(1V8).12) U55.167(VDD(1V8).13)
+3.3V: C291.1 C292.1 C293.1 C309.1 C315.1 C316.1 C317.1 C318.1 C323.2 C383.1 C385.1 C386.1 C387.1 C388.1 C391.2 C413.1 C414.1 C417.1 C418.1 C419.1 D23.1(A) L4.1 R230.2 R244.1 R259.1 R261.2 R269.2 R278.2 R279.2 R280.2 R281.2 R284.2 R287.2 R290.2 R293.2 R308.1 R313.2 R314.2 R318.2 R320.2 R321.2 R323.2 R324.2 R326.2 R327.2 R329.2 RN12.2 RN12.4 RN12.6 RN12.8 RN17.2 RN17.4 RN17.6 RN17.8 U4.1(1DIR) U4.7(VCCB) U4.18(VCCB) U4.31(VCCA) U4.42(VCCA) U34.1(1DIR) U34.7(VCCB) U34.18(VCCB) U34.24(2DIR) U34.31(VCCA) U34.42(VCCA) U42.18(VDRIVE) U52.1(VCCA) U52.16(VCCB) U53.1(1DIR) U53.7(VCCB) U53.18(VCCB) U53.24(2DIR) U53.31(VCCA) U53.42(VCCA) U54.18(VDRIVE) U61.6(VIO) U62.2(VCC) U62.8(VCC)
+3.3VDM: C313.1 C320.1 C346.2 C347.2 C348.2 C349.2 C350.2 C351.2 C352.2 C353.2 C406.1 C408.2 D24.2(K) JP2.5 LED5.1(A) LED13.1(A) R15.1 R257.2 R258.2 R259.2 R277.1 R303.1 R306.1 R307.1 R309.1 R311.2 R312.1 R331.1 R336.1 R346.2 R352.1 R353.1 R358.2 R361.2 R362.2 R363.2 U51.3(Vin) U55.9(VDDIO(3V3).1) U55.71(VDDIO(3V3).2) U55.93(VDDIO(3V3).3) U55.107(VDDIO(3V3).4) U55.121(VDDIO(3V3).5) U55.143(VDDIO(3V3).6) U55.159(VDDIO(3V3).7) U55.170(VDDIO(3V3).8) U58.23(Vcc(3.3V)) U58.24(Vcc(3.3V)) U59.5(Vcc) U60.8(VCC)  [also labelled +3.3VD]
+3V3A: C343.2 C344.2 C345.2 R277.2 U55.34(VDDA2(A3V3)) U55.45(VDDAIO(A3V3))
+5V: C17.1 C228.1 C237.2 C238.2 C254.1 C255.1 C258.1 C265.1 C266.2 C294.1 C295.2 C367.1 C368.2 C405.2 C415.1 C416.1 D21.1(A) L3.1 P2.1 R39.1 R40.1 R229.1 R239.2 R263.1 R283.2 RN11.1 RN11.3 RN11.5 RN11.7 RN13.1 RN13.3 RN13.5 RN13.7 RN14.1 RN14.3 RN14.5 RN14.7 RN15.1 RN15.3 RN15.5 RN15.7 RN16.1 RN16.3 RN16.5 RN16.7 RN18.1 RN18.3 RN18.5 RN18.7 U35.8(VCC) U42.6(DVDD) U46.2(VIN) U54.6(DVDD) U58.1(Vcc(+5V)) U61.8(VCC)
+5VA: C242.1 C284.1 C285.2 C311.1 C312.1 C327.1 C328.1 C373.1 C374.2 C393.1 C395.1 P3.11 P3.26 P4.2 R203.1 R219.2 R229.2 R283.1 U42.43(AVDD) U48.8(V+) U49.8(V+) U50.8(V+) U54.43(AVDD) U56.3(Vin) U57.4 ; port +5VA
+12V: C16.1 C233.1 C234.2 C235.2 C263.1 C264.2 C286.1 C287.1 C288.1 C289.1 C377.1 C378.1 C379.1 LED9.1(A) P4.1 R236.1 U32.8(V+) U39.2(VIN) UP4.3(+Vo) ; port +12V
+28V: C214.1 C221.1 C222.1 C223.1 C276.1 C277.2 D13.2(K) DR2.1(A) T3.4 T4.2
+28VB: C269.2 C270.1 C271.1 C272.2 R256.2 T4.1 UP6.2(Vin)
+CAN5V: C11.1 C410.1 C411.1 C412.1 LED15.1(A) U61.12(VISOOUT) U61.19(VISOIN)
AGND: C1.1 C2.1 C242.2 C259.2 C260.2 C261.2 C262.2 C267.2 C268.2 C284.2 C285.1 C286.2 C287.2 C288.2 C289.2 C299.1 C300.1 C301.1 C302.1 C303.1 C304.1 C311.2 C312.2 C319.1 C324.1 C325.1 C326.1 C327.2 C328.2 C329.1 C330.1 C343.1 C344.1 C345.1 C354.1 C355.1 C360.1 C361.1 C362.2 C363.2 C364.2 C365.2 C369.2 C370.2 C371.1 C372.1 C373.2 C374.1 C377.2 C378.2 C379.2 C380.2 C381.2 C382.2 C389.2 C392.2 C393.2 C394.2 C395.2 C396.2 C397.2 C398.2 C399.2 C400.2 P3.15 P3.30 P4.3 R17.2 R18.2 R19.2 R20.2 R21.2 R22.2 R198.1 R216.2 R231.1 R296.1 R299.2 R325.1 R328.1 R330.1 R341.1 R342.1 R343.2 R344.2 U32.4(V-) U42.40(AGND) U48.4(V-) U49.4(V-) U50.4(V-) U54.40(AGND) U55.32(VSS1AGND) U55.33(VSSA2(AGND)) U55.44(VSSAIO(AGND)) U55.58(VSS2AGND) U56.1(GND) U57.11 ; port AGND
CANGND: C11.2 C410.2 C411.2 C412.2 R367.1 R371.1 U61.11(GND2) U61.13(GND2) U61.16(GND2) U61.20(GND2) ; port CANGND
EN_WK: R23.1 RN20.3 U58.9(A7)
GND: C10.2 C16.2 C17.2 C228.2 C233.2 C234.1 C235.1 C237.1 C238.1 C254.2 C255.2 C263.2 C264.1 C265.2 C266.1 C273.1 C274.1 C291.2 C292.2 C294.2 C295.1 C296.1 C297.1 C309.2 C310.1 C313.2 C314.2 C315.2 C316.2 C317.2 C318.2 C320.2 C321.2 C322.1 C323.1 C331.1 C332.1 C333.1 C334.1 C335.1 C336.1 C337.1 C338.1 C339.1 C340.1 C341.1 C342.1 C346.1 C347.1 C348.1 C349.1 C350.1 C351.1 C352.1 C353.1 C356.2 C357.2 C358.2 C359.2 C366.1 C367.2 C368.1 C375.2 C376.2 C383.2 C384.1 C385.2 C386.2 C387.2 C388.2 C390.1 C391.1 C401.2 C402.2 C403.2 C404.2 C405.1 C406.2 C407.2 C408.1 C409.2 C413.2 C414.2 C415.2 C416.2 C417.2 C418.2 C419.2 D20.1(A) D22.1(A) JP2.4 JP2.8 JP2.10 JP2.12 P2.4 P4.4 R27.1 R210.1 R226.1 R227.1 R231.2 R234.2 R240.1 R241.1 R242.1 R243.2 R245.1 R247.1 R253.1 R254.1 R255.1 R262.2 R273.1 R274.2 R276.1 R289.1 R294.1 R296.2 R299.1 R302.1 R310.1 R359.2 R364.2 RN19.2 RN19.4 RN19.6 RN19.8 RN20.2 RN20.4 RN20.6 RN20.8 U4.4(GND) U4.10(GND) U4.15(GND) U4.21(GND) U4.24(2DIR) U4.25(2/OE) U4.28(GND) U4.34(GND) U4.39(GND) U4.45(GND) U4.48(1/OE) U34.4(GND) U34.10(GND) U34.15(GND) U34.21(GND) U34.28(GND) U34.34(GND) U34.39(GND) U34.45(GND) U35.5(GND) U39.7(GND) U39.9(PAD) U42.5(DGND) U42.19(DGND) U46.7(GND) U46.9(PAD) U52.2(1DIR) U52.3(2DIR) U52.8(GND) U52.9(GND) U53.4(GND) U53.10(GND) U53.15(GND) U53.21(GND) U53.28(GND) U53.34(GND) U53.39(GND) U53.45(GND) U54.5(DGND) U54.19(DGND) U55.3(VSS.1) U55.8(VSS.2) U55.14(VSS.3) U55.22(VSS.4) U55.30(VSS.5) U55.60(VSS.6) U55.70(VSS.7) U55.83(VSS.8) U55.92(VSS.9) U55.103(VSS.10) U55.105(XCLKIN) U55.106(VSS.11) U55.108(VSS.12) U55.118(VSS.13) U55.120(VSS.14) U55.125(VSS.15) U55.140(VSS.16) U55.144(VSS.17) U55.147(VSS.18) U55.155(VSS.19) U55.160(VSS.20) U55.166(VSS.21) U55.171(VSS.22) U58.2(DIR) U58.11(GND) U58.12(GND) U58.13(GND) U59.2(Gnd) U60.4(VSS) U61.1(GND1) U61.3(GND1) U61.7(GND1) U61.9(GND1) U61.10(GND1) U62.1(GND1) U62.3(GND1) U62.5(~{RE}) U62.9(GND1) U62.10(GND1) UP4.5(-Vo) ; port GND
ISO_+15V: C12.1 C13.2 C14.2 C15.2 C256.1 C257.1 C278.1 C279.1 C280.2 C281.2 C282.2 C283.1 C305.2 C306.2 C307.2 C308.2 LED10.1(A) P1.1 P3.1 P3.16 R192.1 U3.6(VCC) U35.1(ANODE1) U35.4(ANODE2) U37.6(VCC) U38.6(VCC) U40.6(VCC) U41.6(VCC) U43.6(VCC) U44.6(VCC) U45.6(VCC) UP6.3(+Vo)
ISO_GND: C12.2 C13.1 C14.1 C15.1 C256.2 C257.2 C278.2 C279.2 C280.1 C281.1 C282.1 C283.2 C305.1 C306.1 C307.1 C308.1 P1.3 P3.2 P3.8 P3.17 P3.23 R275.1 U3.4(VEE) U37.4(VEE) U38.4(VEE) U40.4(VEE) U41.4(VEE) U43.4(VEE) U44.4(VEE) U45.4(VEE) UP6.5(-Vo)
RS422_+5V: C420.1 C421.1 C422.1 LED14.1(A) U62.12(VISOOUT) U62.19(VISOIN)
RS422_GND: C420.2 C421.2 C422.2 R365.1 U62.11(GND2) U62.14(GND2) U62.16(GND2) U62.20(GND2) ; port RS422_GND
VALVE_CTRLB: R26.1 RN20.1 U58.10(A8)
VCC_IN: F1.1 P9.1 ; port VCC_IN
VDD3VFLM: C10.1 C401.1 C402.1 R15.2 U55.84(VDD3VFL.1)
VDDA_1V8M: C398.1 C399.1 C400.1 R16.2 U55.31(VDD1A18) U55.59(VDD2A18)
VREF_2V5: C394.1 C396.1 LED12.1(A) R334.1 R335.1 U56.2(Vout)
1PWM1: P3.3 R252.2
1PWM2: P3.18 R235.2
1PWM3: P3.4 R224.2
1PWM4: P3.19 R251.2
1PWM5: P3.5 R237.2
1PWM6: P3.20 R223.2
#CS_RAM: R316.2
#CSZ0&Z1: R315.1 U55.145(GPIO36/SCIRXDA/XZCS0n)
#CSZ0ANDZ1: R315.2
#CSZ6&Z7: R316.1 U55.150(GPIO37/ECAP2/XZCS7n)
#PDPINTA: R336.2 R337.2 U55.24(GPIO13/TZ2n/CANRXB/MDRB)
#RD: R319.2
#RESET: R346.1 R355.1 U55.80(XRSn)
#TRST: C366.2 JP2.2 R302.2 U55.78(TRSTn)
#WR: R317.2
#XRD: R319.1 U55.149(XRDn)
#XWE: R317.1 U55.137(GPIO38/XWE0n)
A_COS+: R217.1 R220.2 ; port A_COS+
A_COS+': C251.2 R217.2 U42.45(COS)
A_COS-: R225.2 R228.1 ; port A_COS-
A_COS-': C251.1 R228.2 U42.44(COSLO)
A_~{EXC}: C248.2 U42.39(~{EXC})
A_EXC: C225.2 U42.38(EXC)
A_EXCN: C250.1 R216.1 ; port A_EXCN
A_EXCP: C224.1 R198.2 ; port A_EXCP
A_RDC_A: R279.1 U42.29(A)
A_RDC_A0: R280.1 U34.5(1B3) U42.37(A0)
A_RDC_A1: R281.1 U34.6(1B4) U42.36(A1)
A_RDC_B: R278.1 U42.30(B)
A_RDC_CS: R290.1 U34.8(1B5) U42.2(~{CS})
A_RDC_DIR: RN12.5 U42.32(DIR)
A_RDC_DOS: RN12.1 U42.35(DOS)
A_RDC_FSYNC: U34.9(1B6) U42.4(~{WR}/~{FSYNC})
A_RDC_LOT: RN12.3 U42.34(LOT)
A_RDC_NM: RN12.7 U42.31(NM)
A_RDC_RES0: R284.1 U34.2(1B1) U42.48(RES0)
A_RDC_RES1: R287.1 U34.3(1B2) U42.1(RES1)
A_RDC_RESET: R261.1 U34.14(2B2) U42.33(~{RESET})
A_RDC_SAMPLE: R293.1 U34.13(2B1) U42.10(~{SAMPLE})
A_RDC_SCLK: U34.12(1B8) U42.13(DB13/SCLK)
A_RDC_SDI: U34.11(1B7) U42.12(DB14/SDI)
A_RDC_SDO: U42.11(DB15/SDO) U52.11(2B1)
A_REFOUT: C259.1 C260.1 C261.1 C262.1 R200.1 R205.1 R220.1 R225.1 U42.47(REFOUT) ; port A_REFOUT
A_SIN+: R197.1 R200.2 ; port A_SIN+
A_SIN+': C227.2 R197.2 U42.41(SIN)
A_SIN-: R205.2 R213.1 ; port A_SIN-
A_SIN-': C227.1 R213.2 U42.42(SINLO)
ADCINA0: C355.2 R298.1 U55.42(ADCINA0)
ADCINA1: C361.2 R301.1 U55.41(ADCINA1)
ADCINA2: C372.2 R305.1 U55.40(ADCINA2)
ADCINA3: C354.2 R297.1 U55.39(ADCINA3)
ADCINA4: C360.2 R300.1 U55.38(ADCINA4)
ADCINA5: C371.2 R304.1 U55.37(ADCINA5)
ADCINA6: C1.2 R3.1 U55.36(ADCINA6)
ADCINA7: C2.2 R4.1 U55.35(ADCINA7)
ADCINB0: U55.46(ADCINB0)
ADCINB1: U55.47(ADCINB1)
ADCINB2: U55.48(ADCINB2)
ADCINB3: U55.49(ADCINB3)
ADCINB4: U55.50(ADCINB4)
ADCINB5: U55.51(ADCINB5)
ADCINB6: U55.52(ADCINB6)
ADCINB7: U55.53(ADCINB7)
ADCLO: R328.2 U55.43(ADCLO)
ADCREFIN: C392.1 U55.54(ADCREFIN)
ADCREFM: C382.1 C389.1 U55.55(ADCREFM)
ADCREFP: C380.1 C381.1 U55.56(ADCREFP)
ADCREXT: R325.2 U55.57(ADCRESEXT)
ARDC_CS: R230.1 U34.25(2/OE) U34.41(1A5) U34.48(1/OE) U52.14(2~{OE}) U55.94(GPIO52/EQEP1S/XD27)
B_COS+': U54.45(COS) ; port B_COS+'
B_COS-': U54.44(COSLO) ; port B_COS-'
B_~{EXC}: U54.39(~{EXC}) ; port B_~{EXC}
B_EXC: U54.38(EXC) ; port B_EXC
B_RDC_A: R320.1 U54.29(A)
B_RDC_A0: R321.1 U53.5(1B3) U54.37(A0)
B_RDC_A1: R323.1 U53.6(1B4) U54.36(A1)
B_RDC_B: R318.1 U54.30(B)
B_RDC_CS: R327.1 U53.8(1B5) U54.2(~{CS})
B_RDC_DIR: RN17.5 U54.32(DIR)
B_RDC_DOS: RN17.1 U54.35(DOS)
B_RDC_FSYNC: U53.9(1B6) U54.4(~{WR}/~{FSYNC})
B_RDC_LOT: RN17.3 U54.34(LOT)
B_RDC_NM: RN17.7 U54.31(NM)
B_RDC_RES0: R324.1 U53.2(1B1) U54.48(RES0)
B_RDC_RES1: R326.1 U53.3(1B2) U54.1(RES1)
B_RDC_RESET: R314.1 U53.14(2B2) U54.33(~{RESET})
B_RDC_SAMPLE: R329.1 U53.13(2B1) U54.10(~{SAMPLE})
B_RDC_SCLK: U53.12(1B8) U54.13(DB13/SCLK)
B_RDC_SDI: U53.11(1B7) U54.12(DB14/SDI)
B_RDC_SDO: U52.13(1B1) U54.11(DB15/SDO)
B_REFOUT: C362.1 C363.1 C364.1 C365.1 U54.47(REFOUT) ; port B_REFOUT
B_SIN+': U54.41(SIN) ; port B_SIN+'
B_SIN-': U54.42(SINLO) ; port B_SIN-'
BC_SLT: P4.17 U4.19(2B5) ; port BC_SLT
BC_SLT_IN: U4.30(2A5) U55.13(GPIO6/EPWM4A/EPWMSYNCI/EPWMSYNCO)
BRDC_CS: R313.1 U52.15(1~{OE}) U53.25(2/OE) U53.41(1A5) U53.48(1/OE) U55.68(GPIO24/ECAP1/EQEP2A/MDXB)
CANH: R370.1 U61.17(CANH) ; port CANH
CANL: R370.2 U61.15(CANL) ; port CANL
CANRXA: R368.2 U55.62(GPIO18/SPICLKA/SCITXDB/CANRXA)
CANTXA: R369.2 U55.63(GPIO19/SPISTEAn/SCIRXDB/CANTXA)
EMU0: C375.1 JP2.13 R311.1 U55.85(EMU0)
EMU1: C376.1 JP2.14 R312.2 U55.86(EMU1)
EN_TXD: P4.16 U4.17(2B4) ; port EN_TXD
EN_WORK: U55.27(GPIO16/SPISIMOA/CANTXB/TZ5n) U58.15(B7)
EN_WRK: P3.6 R248.2
ENA_TXD: U4.32(2A4) U62.6(DE)
ET_IO_IN1: U4.27(2A7) U55.16(GPIO7/EPWM4B/MCLKRA/ECAP2)
ET_IO_IN2: U4.26(2A8) U55.17(GPIO8/EPWM5A/CANTXB/ADCSOCAOn)
ET_IO_OUT1: U4.41(1A5) U55.100(GPIO58/MCLKRA/XD21)
ET_IO_OUT2: U4.40(1A6) U55.110(GPIO59/MFSRA/XD20)
EXT_IO_IN1: P4.19 U4.22(2B7) ; port EXT_IO_IN1
EXT_IO_IN2: P4.20 U4.23(2B8) ; port EXT_IO_IN2
EXT_IO_OUT1: P4.9 U4.8(1B5) ; port EXT_IO_OUT1
EXT_IO_OUT2: P4.10 U4.9(1B6) ; port EXT_IO_OUT2
FAULT: D16.2(K) P3.21
I_O_IN1: U4.35(2A2) U55.69(GPIO25/ECAP2/EQEP2B/MDRB)
I_O_IN2: U4.33(2A3) U55.72(GPIO26/ECAP3/EQEP2I/MCLKXB)
I_O_OUT1: U4.47(1A1) U55.73(GPIO27//ECAP4/EQEP2S/MFSXB)
I_O_OUT2: U4.46(1A2) U55.74(GPIO32/SDAA/EPWMSYNCI/ADCSOCAOn)
IGBT_FLT: R337.1 U4.44(1A3) U35.7(OUTPUT1)
IGBT_FO: P4.7 U4.5(1B3) ; port IGBT_FO
IGBT_PCTRLB: R258.1 U47.3 U55.28(GPIO17/SPISOMIA/CANRXB/TZ6n)
II_1_AC1: P3.12 R272.1
II_1_AC1_IN: C301.2 R19.1 R267.2 R298.2
II_1_AC2: P3.27 R292.1
II_1_AC2_IN: C325.2 R20.1 R286.2 R301.2
II_1_AC3: P3.13 R270.1
II_1_AC3_IN: C299.2 R21.1 R265.2 R305.2
II_1_DC1: P3.28 R288.1
II_1_DC1_IN: C319.2 R22.1 R282.2 R304.2
IO_IN1: P4.14 U4.14(2B2) ; port IO_IN1
IO_IN2: P4.15 U4.16(2B3) ; port IO_IN2
IO_OUT1: P4.5 U4.2(1B1) ; port IO_OUT1
IO_OUT2: P4.6 U4.3(1B2) ; port IO_OUT2
LED1: R347.1 U55.89(GPIO49/ECAP6/XD30)
LED2: R41.1 U55.75(GPIO33/SCLA/EPWMSYNCO/ADCSOCBOn)
MS_SLT: P4.18 U4.20(2B6) ; port MS_SLT
MS_SLT_IN: U4.29(2A6) U55.20(GPIO11/EPWM6B/SCIRXDB/ECAP4)
OPEN_INT1: R352.2 U55.21(GPIO12/TZ1n/CANTXB/MDXB) U58.22(~{OE})
PT1000_AN1: R343.1 ; port PT1000_AN1
PT1000_AP1: R335.2 U57.12(IN+) ; port PT1000_AP1
PWM1: U55.5(GPIO0/EPWM1A) U58.21(B1)
PWM2: U55.6(GPIO1/EPWM1B/ECAP6/MFSRB) U58.20(B2)
PWM3: U55.7(GPIO2/EPWM2A) U58.19(B3)
PWM4: U55.10(GPIO3/EPWM2B/ECAP5/MCLKRB) U58.18(B4)
PWM5: U55.11(GPIO4/EPWM3A) U58.17(B5)
PWM6: U55.12(GPIO5/EPWM3B/MFSRA/ECAP1) U58.16(B6)
R/#W: R322.2
RDC_A0: U34.44(1A3) U53.44(1A3) U55.65(GPIO21/EQEP1B/MDRA/CANRXB)
RDC_A1: U34.43(1A4) U53.43(1A4) U55.66(GPIO22/EQEP1S/MCLKXA/SCITXDB)
RDC_FSYNC: U34.40(1A6) U53.40(1A6) U55.99(GPIO57/SPISTEAn/XD22)
RDC_RES0: U34.47(1A1) U53.47(1A1) U55.90(GPIO50/EQEP1A/XD29)
RDC_RES1: U34.46(1A2) U53.46(1A2) U55.91(GPIO51/EQEP1B/XD28)
RDC_RESET: U34.35(2A2) U53.35(2A2) U55.88(GPIO48/ECAP5/XD31)
RDC_SAMPLE: U34.36(2A1) U53.36(2A1) U55.111(GPIO60/MCLKRB/XD19)
RDC_SCLK: R350.2 U34.37(1A8) U53.37(1A8)
RDC_SDI: R349.2 U34.38(1A7) U53.38(1A7)
RDC_SDO: R348.2 U52.4(1A1) U52.6(2A1)
RS422_A: R366.2 U62.18(A) ; port RS422_A
RS422_B: R366.1 U62.17(B) ; port RS422_B
RS422_Y: U62.13(Y) ; port RS422_Y
RS422_Z: U62.15(Z) ; port RS422_Z
SCI_RXDA: U4.36(2A1) U55.141(GPIO28/SCIRXDA/XZCS6n)
SCI_TXDA: U4.43(1A4) U55.2(GPIO29/SCITXDA/XA19)
SCIRXDA: P4.13 U4.13(2B1) ; port SCIRXDA
SCIRXDB: R29.1 U55.26(GPIO15/TZ4n/XHOLDAn/SCIRXDB/MFSXB)
SCIRXDC: U55.113(GPIO62/SCIRXDC/XD17) U62.4(RXD)
SCITXDA: P4.8 U4.6(1B4) ; port SCITXDA
SCITXDB: R30.2 U55.25(GPIO14/TZ3n/XHOLDn/SCITXDB/MCLKXB)
SCITXDC: U55.114(GPIO63/SCITXDC/XD16) U62.7(TXD)
SPICLKA: R350.1 R364.1 U55.98(GPIO56/SPICLKA/XD23) U60.6(SCK)
SPISIMOA: R349.1 R361.1 U55.96(GPIO54/SPISIMOA/XD25) U60.5(SI)
SPISOMIA: R348.1 R363.1 U55.97(GPIO55/SPISOMIA/XD24) U60.2(SO)
SPISTEA: R362.1 U55.112(GPIO61/MFSRB/XD18) U60.1(~{CS})
SYN_CLK_IN: P4.12 U55.19(GPIO10/EPWM6A/CANRXB/ADCSOCBOn) ; port SYN_CLK_IN
SYN_CLK_OUT: P4.11 U4.11(1B7) ; port SYN_CLK_OUT
SYN_CLKOUT: U4.38(1A7) U55.18(GPIO9/EPWM5B/SCITXDB/ECAP3)
TCK: JP2.9 JP2.11 R309.2 U55.87(TCK)
TDI: JP2.3 R306.2 U55.76(TDI)
TDO: JP2.7 R307.2 U55.77(TDO)
TEMP: P3.29 R291.1
TEMP_A1: C397.1 R3.2 R338.2 R341.2
TEMP_B1: R4.2 ; port TEMP_B1
TEMP_IN: C324.2 R18.1 R285.2 R300.2
TMS: JP2.1 R303.2 U55.79(TMS)
VAL_CTRL: P1.2 P3.7 R28.2
VALVE_CTRL: U55.64(GPIO20/EQEP1A/MDXA/CANTXB) U58.14(B8)
VDC1: P3.14 R271.1
VDC1_IN: C300.2 R17.1 R266.2 R297.2
WP1: U55.95(GPIO53/EQEP1I/XD26) U60.3(~{WP})
XA17: U55.176(GPIO31/CANTXA/XA17)
XA18: U55.1(GPIO30/CANRXA/XA18)
XCLOUT: R345.2
XR/#W: R322.1 U55.148(GPIO35/SCITXDA/XRnW)
XREADY: R331.2 U55.142(GPIO34/ECAP1/XREADY)
NetC224_2: C224.2 R207.2 U32.1(OUT1)
NetC225_1: C225.1 R195.1 R203.2
NetC236_1: C236.1 R207.1 R209.2 U32.2(IN1-)
NetC236_2: C236.2 R209.1 R214.1 U32.6(IN2-)
NetC241_1: C241.1 R212.1 R221.2 R222.1
NetC241_2: C241.2 R195.2 R196.1 R212.2
NetC248_1: C248.1 R219.1 R221.1
NetC250_2: C250.2 R214.2 U32.7(OUT2)
NetC252_1: C252.1 D20.2(K) L3.2 U39.8(PH)
NetC252_2: C252.2 U39.1(BOOT)
NetC258_2: C258.2 R238.1 R242.2 U39.5(VSNS)
NetC267_1: C267.1 C268.1 U42.46(REFBYP)
NetC273_2: C273.2 U39.4(SS)
NetC274_2: C274.2 C275.2 U39.6(COMP)
NetC275_1: C275.1 R245.2
NetC290_1: C290.1 D22.2(K) L4.2 U46.8(PH)
NetC290_2: C290.2 U46.1(BOOT)
NetC293_2: C293.2 R268.1 R273.2 U46.5(VSNS)
NetC296_2: C296.2 U46.4(SS)
NetC297_2: C297.2 C298.2 U46.6(COMP)
NetC298_1: C298.1 R276.2
NetC302_2: C302.2 R270.2 U48.5(IN2+)
NetC303_2: C303.2 R271.2 U49.3(IN1+)
NetC304_2: C304.2 R272.2 U50.5(IN2+)
NetC310_2: C310.2 U42.8(XTALOUT) Y3.2
NetC322_2: C322.2 U42.7(CLKIN) Y3.1
NetC326_2: C326.2 R288.2 U48.3(IN1+)
NetC329_2: C329.2 R291.2 U49.5(IN2+)
NetC330_2: C330.2 R292.2 U50.3(IN1+)
NetC369_1: C369.1 C370.1 U54.46(REFBYP)
NetC384_2: C384.2 U54.8(XTALOUT) Y4.2
NetC390_2: C390.2 U54.7(CLKIN) Y4.1
NetC403_1: C403.1 U55.102(X2) X2.2
NetC404_1: C404.1 U55.104(X1) X2.1
NetC407_1: C407.1 D24.1(A) R353.2 U59.1(A)
NetC409_1: C409.1 R356.2 R359.1 U59.3(A)
NetD13_1: D13.1(A) F1.2
NetD16_1: D16.1(A) R192.2 R194.2
NetD21_2: D21.2(K) R234.1
NetD23_2: D23.2(K) R262.1
NetLED5_2: LED5.2(K) R41.2
NetLED9_2: LED9.2(K) R210.2
NetLED10_2: LED10.2(K) R275.2
NetLED11_2: LED11.2(K) R289.2
NetLED12_2: LED12.2(K) R330.2
NetLED13_2: LED13.2(K) R347.2
NetLED14_2: LED14.2(K) R365.2
NetLED15_2: LED15.2(K) R371.2
NetP2_2: P2.2 R29.2
NetP2_3: P2.3 R30.1
NetQ2_1: Q2.1(B) R260.1 R264.1
NetQ2_3: Q2.3(C) R250.1
NetR23_2: R23.2 U43.1(ANODE)
NetR26_2: R26.2 U3.1(ANODE)
NetR27_2: R27.2 U3.3(CATHODE)
NetR28_1: R28.1 U3.5(Vo)
NetR39_2: R39.2 U54.20(DB8)
NetR40_2: R40.2 U42.20(DB8)
NetR194_1: R194.1 U35.2(CATHODE1)
NetR196_2: R196.2 U32.3(IN1+)
NetR215_2: R215.2 U37.1(ANODE)
NetR218_2: R218.2 U38.1(ANODE)
NetR222_2: R222.2 U32.5(IN2+)
NetR223_1: R223.1 U38.5(Vo)
NetR224_1: R224.1 U37.5(Vo)
NetR226_2: R226.2 U37.3(CATHODE)
NetR227_2: R227.2 U38.3(CATHODE)
NetR232_2: R232.2 U40.1(ANODE)
NetR233_2: R233.2 U41.1(ANODE)
NetR235_1: R235.1 U41.5(Vo)
NetR236_2: R236.2 R243.1 U39.3(EN)
NetR237_1: R237.1 U40.5(Vo)
NetR238_2: R238.2 R239.1
NetR240_2: R240.2 U40.3(CATHODE)
NetR241_2: R241.2 U41.3(CATHODE)
NetR244_2: R244.2 U42.3(~{RD})
NetR246_2: R246.2 U44.1(ANODE)
NetR247_2: R247.2 U43.3(CATHODE)
NetR248_1: R248.1 U43.5(Vo)
NetR249_2: R249.2 U45.1(ANODE)
NetR250_2: R250.2 UP6.6(CTRL)
NetR251_1: R251.1 U45.5(Vo)
NetR252_1: R252.1 U44.5(Vo)
NetR253_2: R253.2 U44.3(CATHODE)
NetR254_2: R254.2 U45.3(CATHODE)
NetR255_2: R255.2 U42.9(~{SOE})
NetR256_1: R256.1 R260.2 U47.6
NetR257_1: R257.1 U47.1
NetR263_2: R263.2 R274.1 U46.3(EN)
NetR265_1: R265.1 U48.6(IN2-) U48.7(OUT2)
NetR266_1: R266.1 U49.1(OUT1) U49.2(IN1-)
NetR267_1: R267.1 U50.6(IN2-) U50.7(OUT2)
NetR268_2: R268.2 R269.1
NetR282_1: R282.1 U48.1(OUT1) U48.2(IN1-)
NetR285_1: R285.1 U49.6(IN2-) U49.7(OUT2)
NetR286_1: R286.1 U50.1(OUT1) U50.2(IN1-)
NetR294_2: R294.2 R295.1 U51.1(GND)
NetR308_2: R308.2 U54.3(~{RD})
NetR310_2: R310.2 U54.9(~{SOE})
NetR332_1: R332.1 R338.1 U57.1(OUT)
NetR332_2: R332.2 R333.1 U57.2(IN-)
NetR333_2: R333.2 U57.8(OUT) U57.9(IN-)
NetR334_2: R334.2 R340.1 U57.10(IN+)
NetR339_1: R339.1 R344.1 U57.3(IN+)
NetR339_2: R339.2 U57.13(IN-) U57.14(OUT)
NetR340_2: R340.2 R342.2
NetR345_1: R345.1 U55.138(XCLKOUT)
NetR355_2: R355.2 U59.4(Y)
NetR356_1: R356.1 U59.6(Y)
NetR358_1: R358.1 U60.7(~{HOLD})
NetR367_2: R367.2 U61.18(RS)
NetR368_1: R368.1 U61.4(RXD)
NetR369_1: R369.1 U61.5(TXD)
NetRN11_2: RN11.2 U42.14(DB12)
NetRN11_4: RN11.4 U42.15(DB11)
NetRN11_6: RN11.6 U42.16(DB10)
NetRN11_8: RN11.8 U42.17(DB9)
NetRN13_2: RN13.2 U42.21(DB6)
NetRN13_4: RN13.4 U42.22(DB8)
NetRN13_6: RN13.6 U42.23(DB5)
NetRN13_8: RN13.8 U42.24(DB4)
NetRN14_2: RN14.2 U42.25(DB3)
NetRN14_4: RN14.4 U42.26(DB2)
NetRN14_6: RN14.6 U42.27(DB1)
NetRN14_8: RN14.8 U42.28(DB0)
NetRN15_2: RN15.2 U54.14(DB12)
NetRN15_4: RN15.4 U54.15(DB11)
NetRN15_6: RN15.6 U54.16(DB10)
NetRN15_8: RN15.8 U54.17(DB9)
NetRN16_2: RN16.2 U54.21(DB6)
NetRN16_4: RN16.4 U54.22(DB8)
NetRN16_6: RN16.6 U54.23(DB5)
NetRN16_8: RN16.8 U54.24(DB4)
NetRN18_2: RN18.2 U54.25(DB3)
NetRN18_4: RN18.4 U54.26(DB2)
NetRN18_6: RN18.6 U54.27(DB1)
NetRN18_8: RN18.8 U54.28(DB0)

Not connected (* = marked no-connect by the designer): JP2 6; P3 9 10 22 24 25; U3 2(NC); U4 12(1B8) 37(1A8); U34 16(2B3) 17(2B4) 19(2B5) 20(2B6) 22(2B7) 23(2B8) 26(2A8) 27(2A7) 29(2A6) 30(2A5) 32(2A4) 33(2A3); U35 3(CATOHDE2) 6(OUTPUT2); U37 2(NC); U38 2(NC); U40 2(NC); U41 2(NC); U43 2(NC); U44 2(NC); U45 2(NC); U51 4(NC); U52 5(1A2) 7(2A2) 10(2B2) 12(1B2); U53 16(2B3) 17(2B4) 19(2B5) 20(2B6) 22(2B7) 23(2B8) 26(2A8) 27(2A7) 29(2A6) 30(2A5) 32(2A4) 33(2A3); U55 67(GPIO23/EQEP1I/MFSXA/SCIRXDB) 81((NC)TEST1) 82((NC)TEST2) 115(GPIO64/XD15) 116(GPIO65/XD14) 119(GPIO66/XD13) 122(GPIO67/XD12) 123(GPIO68/XD11) 124(GPIO69/XD10) 127(GPIO70/XD9) 128(GPIO71/XD8) 129(GPIO72/XD7) 130(GPIO73/XD6) 131(GPIO74/XD5) 132(GPIO75/XD4) 133(GPIO76/XD3) 134(GPIO77/XD2) 135(GPIO78/XD1) 136(GPIO79/XD0) 151(GPIO40/XA0/XWE1n) 152(GPIO41/XA1) 153(GPIO42/XA2) 156(GPIO43/XA3) 157(GPIO44/XA4) 158(GPIO45/XA5) 161(GPIO46/XA6) 162(GPIO47/XA7) 163(GPIO80/XA8) 164(GPIO81/XA9) 165(GPIO82/XA10) 168(GPIO83/XA11) 169(GPIO84/XA12) 172(GPIO85/XA13) 173(GPIO86/XA14) 174(GPIO87/XA15) 175(GPIO39/XA16); U56 4(NC); U61 2(NC) 14(VREF); UP4 4(0V) 6(CTRL); UP6 4(0V)

## Notes on the sheet
- 旋转变换器1
- 核心电源去耦电容，在芯片的电源脚处就近放
- 程序下载口
- 旋转变换器2
- 预留调试串口
- (near U61) CANA接口
- Labels drawn without touching a wire or pin: 0.107V~2.33V, 750R~1500R, PT1000, RS422´®¿Ú, Ðý±äÊä³öÐÅºÅ, Ðý±äÊäÈëÐÅºÅ
- (in symbol CAP1) +
- (in symbol TL084D, part A) A
- (in symbol TL084D, part C) C
- (in symbol TL084D, part D) D

## Library data of the parts
C1 C2 C230-C232 C273-C275 C296-C298 C331-C345 C347-C355 C360 C361 C366 C371 C372 C375 C376 = Cap: Capacitor; Published: 8-Jun-2000; Publisher: Altium Limited
  C1 C2 C230-C232 C331-C345 C347-C355 C360 C361 C366 C371 C372 C375 C376: Revision: July-2002: Re-released for DXP Platform.
  C273-C275 C296-C298: LatestRevisionDate: 17-Jul-2002; LatestRevisionNote: Re-released for DXP Platform.; PackageReference: RAD-0.3
C10 C242 C380 C389 C392 C398-C401 C403 C404 = CAP
C11 C212-C216 C224 C227 C236 C241 C250 C251 C259-C262 C266 C268 C284-C287 C310 C320-C323 C327 C328 C356-C359 C362-C365 C368 C370 C373 C374 C377 C378 C384 C390 C391 C395-C397 C407 C409-C422 = CAP: Capacitor
C12 C16 C17 C217-C223 C228 C233 C256 C257 C263 C265 C267 C270 C271 C276 C278 C279 C283 C288 C289 C294 C367 C369 C379 = Cap2: Capacitor; Published: 23-Sep-2002; Publisher: Altium Limited
C13-C15 C225 C234 C235 C237 C238 C248 C252 C258 C264 C269 C272 C277 C280-C282 C290 C293 C295 C299-C308 C315-C319 C324-C326 C329 C330 C346 C385-C388 C408 = Cap Semi: Capacitor (Semiconductor SIM Model); Published: 8-Jun-2000; Revision: July-2002: Re-released for DXP Platform.; Publisher: Altium Limited
C254 C255 C291 C292 C381 C382 C402 = CAP1
C309 C383 = Cap2: Capacitor; Value: 16V/4.7uF; Published: 23-Sep-2002; Publisher: Altium Limited
C311-C314 C393 C394 = ELECTRO1: Electrolytic Capacitor
C405 C406 = 0805: Capacitor; Published: 8-Jun-2000; LatestRevisionDate: 17-Jul-2002; LatestRevisionNote: Re-released for DXP Platform.; PackageReference: RAD-0.3; Publisher: Altium Limited
D13 D20 D22 = DIODE SCHOTTKY: Schottky Diode
D16 = Diode: Default Diode; Published: 8-Jun-2000; LatestRevisionDate: 17-Jul-2002; LatestRevisionNote: Re-released for DXP Platform.; PackageDocument: Sep-1996; PackageReference: SMC; Publisher: Altium Limited; Code_JEDEC: DO-214-AB
D21 D23 = LED0: Typical INFRARED GaAs LED; Published: 8-Jun-2000; LatestRevisionDate: 08-Jul-2005; LatestRevisionNote: Mech Layer 1 removed.; PackageReference: LED-0; Publisher: Altium Limited
D24 = DIODE: Part Fie?>q: *; ?: *; O?À›?ÔL? †: *
DR2 = TVS
F1 = Fuse 2: Fuse; Published: 8-Jun-2000; LatestRevisionDate: 17-Jul-2002; LatestRevisionNote: Re-released for DXP Platform.; PackageReference: PIN-W2/E2.8; Publisher: Altium Limited; PackageDescription: Thru-Hole; 2 Leads
JP2 = HEADER 7X2
L3 L4 = Inductor: Code_IEC: 1005; Value: 10mH; Published: 8-Jun-2000; LatestRevisionDate: 17-Jul-2002; LatestRevisionNote: Re-released for DXP Platform.; PackageReference: 0402-A; Publisher: Altium Limited; Code_JEITA: 0402
LED5 LED9-LED15 = LED2: Typical RED, GREEN, YELLOW, AMBER GaAs LED; Published: 8-Jun-2000; LatestRevisionDate: 17-Jul-2002; LatestRevisionNote: Re-released for DXP Platform.; PackageDocument: Feb-2002; PackageReference: 3.2X1.6X1.1; Publisher: Altium Limited
P1 = Header 3: Header, 3-Pin; LatestRevisionDate: 17-Jul-2002; LatestRevisionNote: Re-released for DXP Platform.; Publisher: Altium Limited
P2 = Header 4: Header, 4-Pin; LatestRevisionDate: 17-Jul-2002; LatestRevisionNote: Re-released for DXP Platform.; Publisher: Altium Limited
P3 = Header 15X2A: Header, 15-Pin, Dual row; LatestRevisionDate: 17-Jul-2002; LatestRevisionNote: Re-released for DXP Platform.; Publisher: Altium Limited
P4 = Header 20: Header, 20-Pin; LatestRevisionDate: 17-Jul-2002; LatestRevisionNote: Re-released for DXP Platform.; Publisher: Altium Limited
P9 = Header 2: Header, 2-Pin; LatestRevisionDate: 17-Jul-2002; LatestRevisionNote: Re-released for DXP Platform.; Publisher: Altium Limited
R3 R4 R17-R22 R28-R30 R39-R41 R192 R195-R198 R200 R203 R205 R207 R209 R210 R212-R214 R216 R217 R219-R225 R228 R230 R231 R235 R237 R244 R248 R251 R252 R255 R261 R265-R267 R270-R272 R275 R278-R293 R297-R301 R304 R305 R308 R310 R313-R324 R326 R327 R329 R330 R332-R344 R346-R350 R352 R358 R361-R364 R367-R370 = Res2: Resistor; Published: 8-Jun-2000; Revision: July-2002: Re-released for DXP Platform.; Publisher: Altium Limited
R15 R16 R229 R234 R236 R238 R239 R242 R243 R245 R259 R262 R263 R268 R269 R273 R274 R276 R277 R294-R296 R325 R328 R331 R345 R366 = RES
R23 R26 R27 R194 R215 R218 R226 R227 R232 R233 R240 R241 R246 R247 R249 R250 R253 R254 R256-R258 R260 R264 = WP_RES
R302 R303 R306 R307 R309 R311 R312 = Res2: Resistor; Value: 4.7K; Published: 8-Jun-2000; Revision: July-2002: Re-released for DXP Platform.; Publisher: Altium Limited
R353 R355 R356 R359 = RES2: Part Fie?>q: *; ?: *; O?À›?ÔL? †: *
R365 R371 = R
RN11-RN20 = WP_RP4
T3 T4 = Trans: Transformer; Published: 24-Mar-1999; LatestRevisionDate: 08-Jul-2005; LatestRevisionNote: Mech Layer 1 removed.; PackageReference: TRANS; Publisher: Altium Limited; PackageDescription: Transformer; 4 Leads
U4 U34 U53 = SN74AVC16T245
U32 U48-U50 = LT1358: Fast Settling Dual Operational Amplifier
U35 = HCPL2531
U42 U54 = AD2S1210
U47 = TLP521-1
U51 U56 = AS1117
U52 = 74AVC4T245
U55 = TMS320F28335-176 QFP
U57 = TL084D: JFET-Input Operational Amplifier; Package Information: Latest Revision: Jan-1998; Published: 16-Jan-2001; Revision: 17-Jul-2002: Re-released for DXP Platform.; Datasheet: Latest Revision: Feb-1999; Package Reference: D014; Publisher: Altium Limited
U58 = SN74LVTH245A: SN74LVC4245
U59 = 74LVC2G14: Part Fie?>q: *; ?: *; O?À›?ÔL? †: *
U60 = X25040
U61 = ADM3053
UP4 UP6 = VRA2415D(X)-10WR2
X2 Y3 Y4 = CRYSTAL